# Altium project Dlgger_Prj.PrjPcb
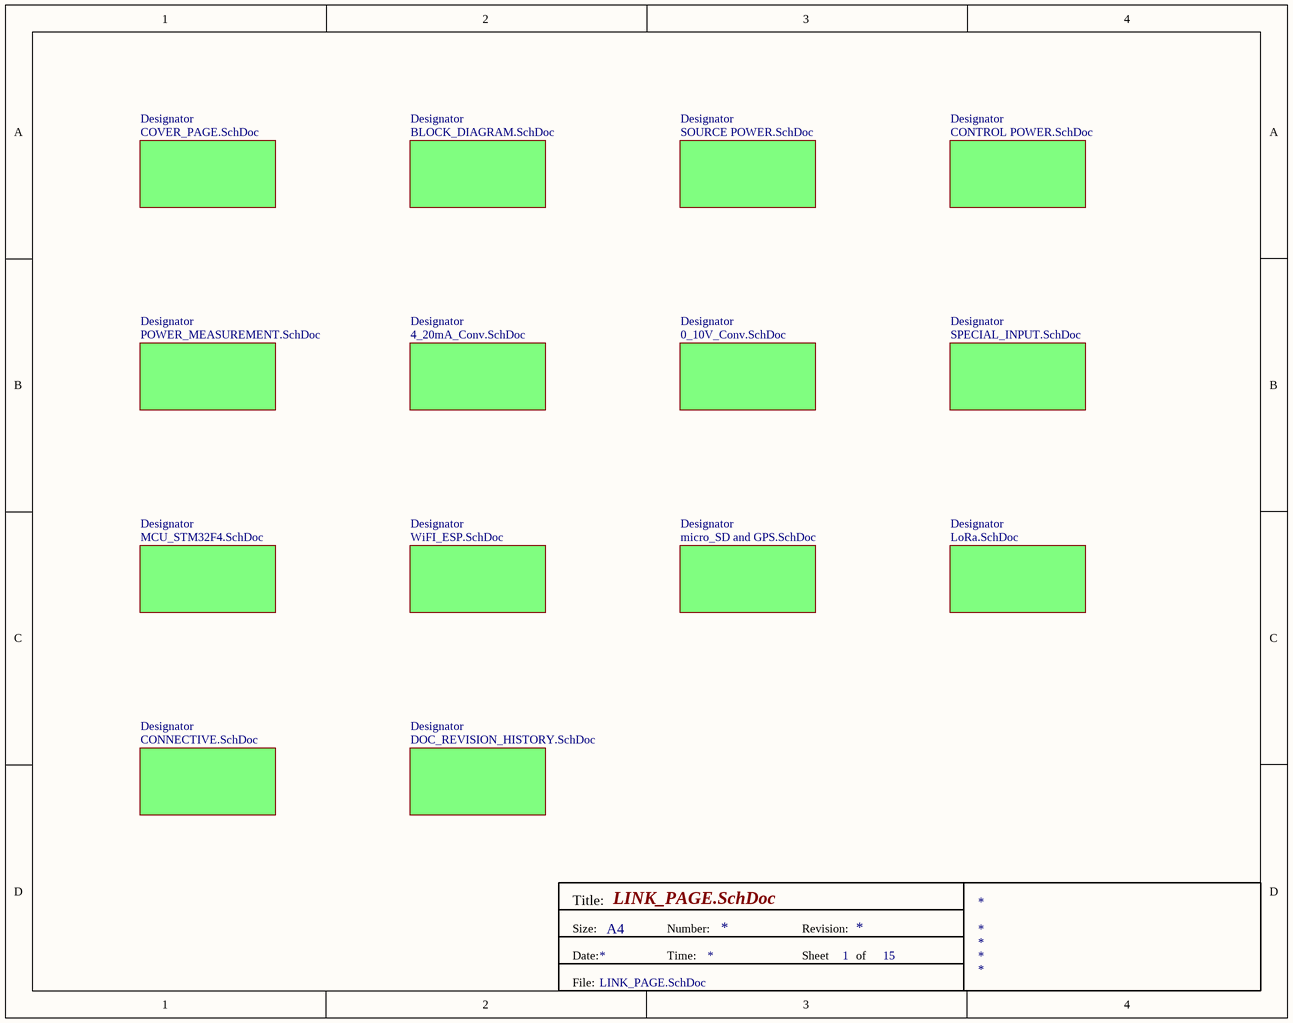
[diagram p0: LINK_PAGE.SchDoc]
15 sheets, 197 parts. Net scope: flat (ports and power ports of the same name join across sheets).
Sheets:
  LINK_PAGE.SchDoc
    Designator = COVER_PAGE.SchDoc
    Designator = BLOCK_DIAGRAM.SchDoc
    Designator = SOURCE POWER.SchDoc
    Designator = CONTROL POWER.SchDoc
    Designator = POWER_MEASUREMENT.SchDoc
    Designator = 4_20mA_Conv.SchDoc
    Designator = 0_10V_Conv.SchDoc
    Designator = SPECIAL_INPUT.SchDoc
    Designator = MCU_STM32F4.SchDoc
    Designator = WiFI_ESP.SchDoc
    Designator = micro_SD and GPS.SchDoc
    Designator = LoRa.SchDoc
    Designator = CONNECTIVE.SchDoc
    Designator = DOC_REVISION_HISTORY.SchDoc

## Sheet LINK_PAGE.SchDoc
size A; SheetNumber: 1; SheetTotal: 15

### Sub-sheets
Designator = COVER_PAGE.SchDoc: no entries
Designator = BLOCK_DIAGRAM.SchDoc: no entries
Designator = SOURCE POWER.SchDoc: no entries
Designator = CONTROL POWER.SchDoc: no entries
Designator = POWER_MEASUREMENT.SchDoc: no entries
Designator = 4_20mA_Conv.SchDoc: no entries
Designator = 0_10V_Conv.SchDoc: no entries
Designator = SPECIAL_INPUT.SchDoc: no entries
Designator = MCU_STM32F4.SchDoc: no entries
Designator = WiFI_ESP.SchDoc: no entries
Designator = micro_SD and GPS.SchDoc: no entries
Designator = LoRa.SchDoc: no entries
Designator = CONNECTIVE.SchDoc: no entries
Designator = DOC_REVISION_HISTORY.SchDoc: no entries

### Notes on the sheet
- Title:
- Size:
- Date:
- A4
- Number:
- Time:
- Revision:
- Sheet
- of
- File:

## Sheet COVER_PAGE.SchDoc
size A4; SheetNumber: 2; SheetTotal: 15
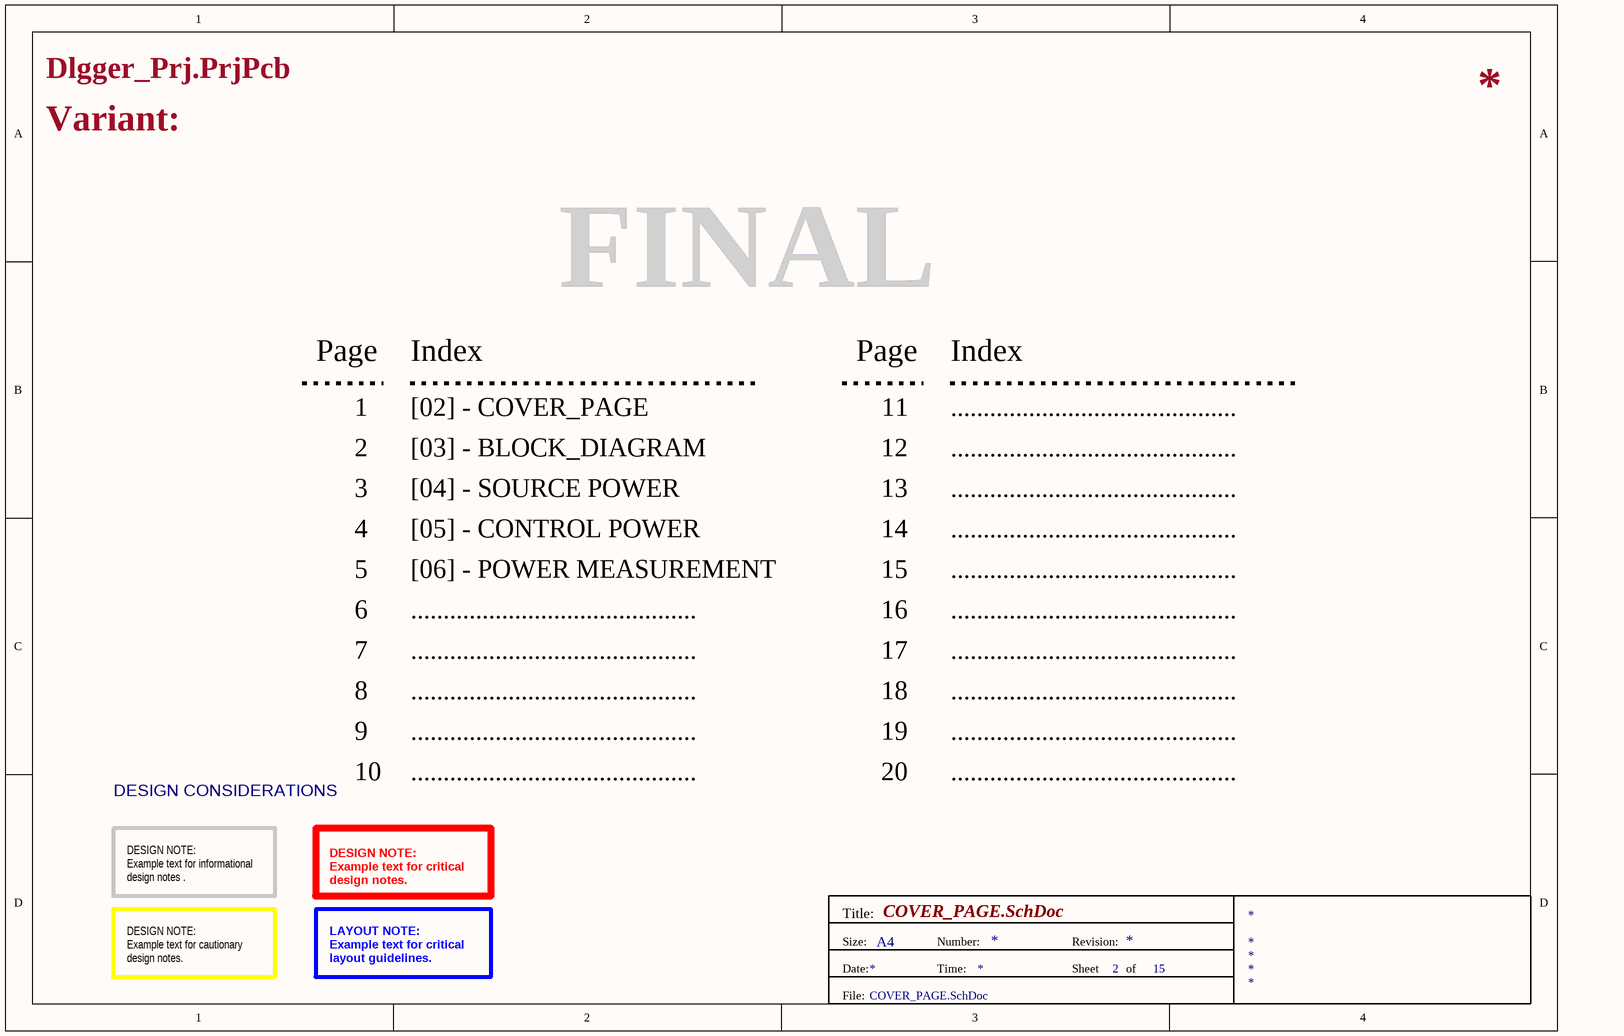
[diagram p1: COVER_PAGE.SchDoc]

### Notes on the sheet
- Variant:
- FINAL
- Page
- Index
- 1
- [02] - COVER_PAGE
- 11
- ............................................
- 2
- 3
- [03] - BLOCK_DIAGRAM
- [04] - SOURCE POWER
- 12
- 13
- 4
- 5
- [05] - CONTROL POWER
- [06] - POWER MEASUREMENT
- 14
- 15
- 6
- 16
- 7
- 8
- 17
- 18
- 9
- 10
- 19
- 20
- DESIGN CONSIDERATIONS
- DESIGN NOTE:
  Example text for informational
  design notes .
- DESIGN NOTE:
  Example text for critical
  design notes.
- Title:
- DESIGN NOTE:
  Example text for cautionary
  design notes.
- LAYOUT NOTE:
  Example text for critical
  layout guidelines.
- Size:
- Date:
- A4
- Number:
- Time:
- Revision:
- Sheet
- of
- File:

## Sheet BLOCK_DIAGRAM.SchDoc
size A3; SheetNumber: 3; SheetTotal: 15
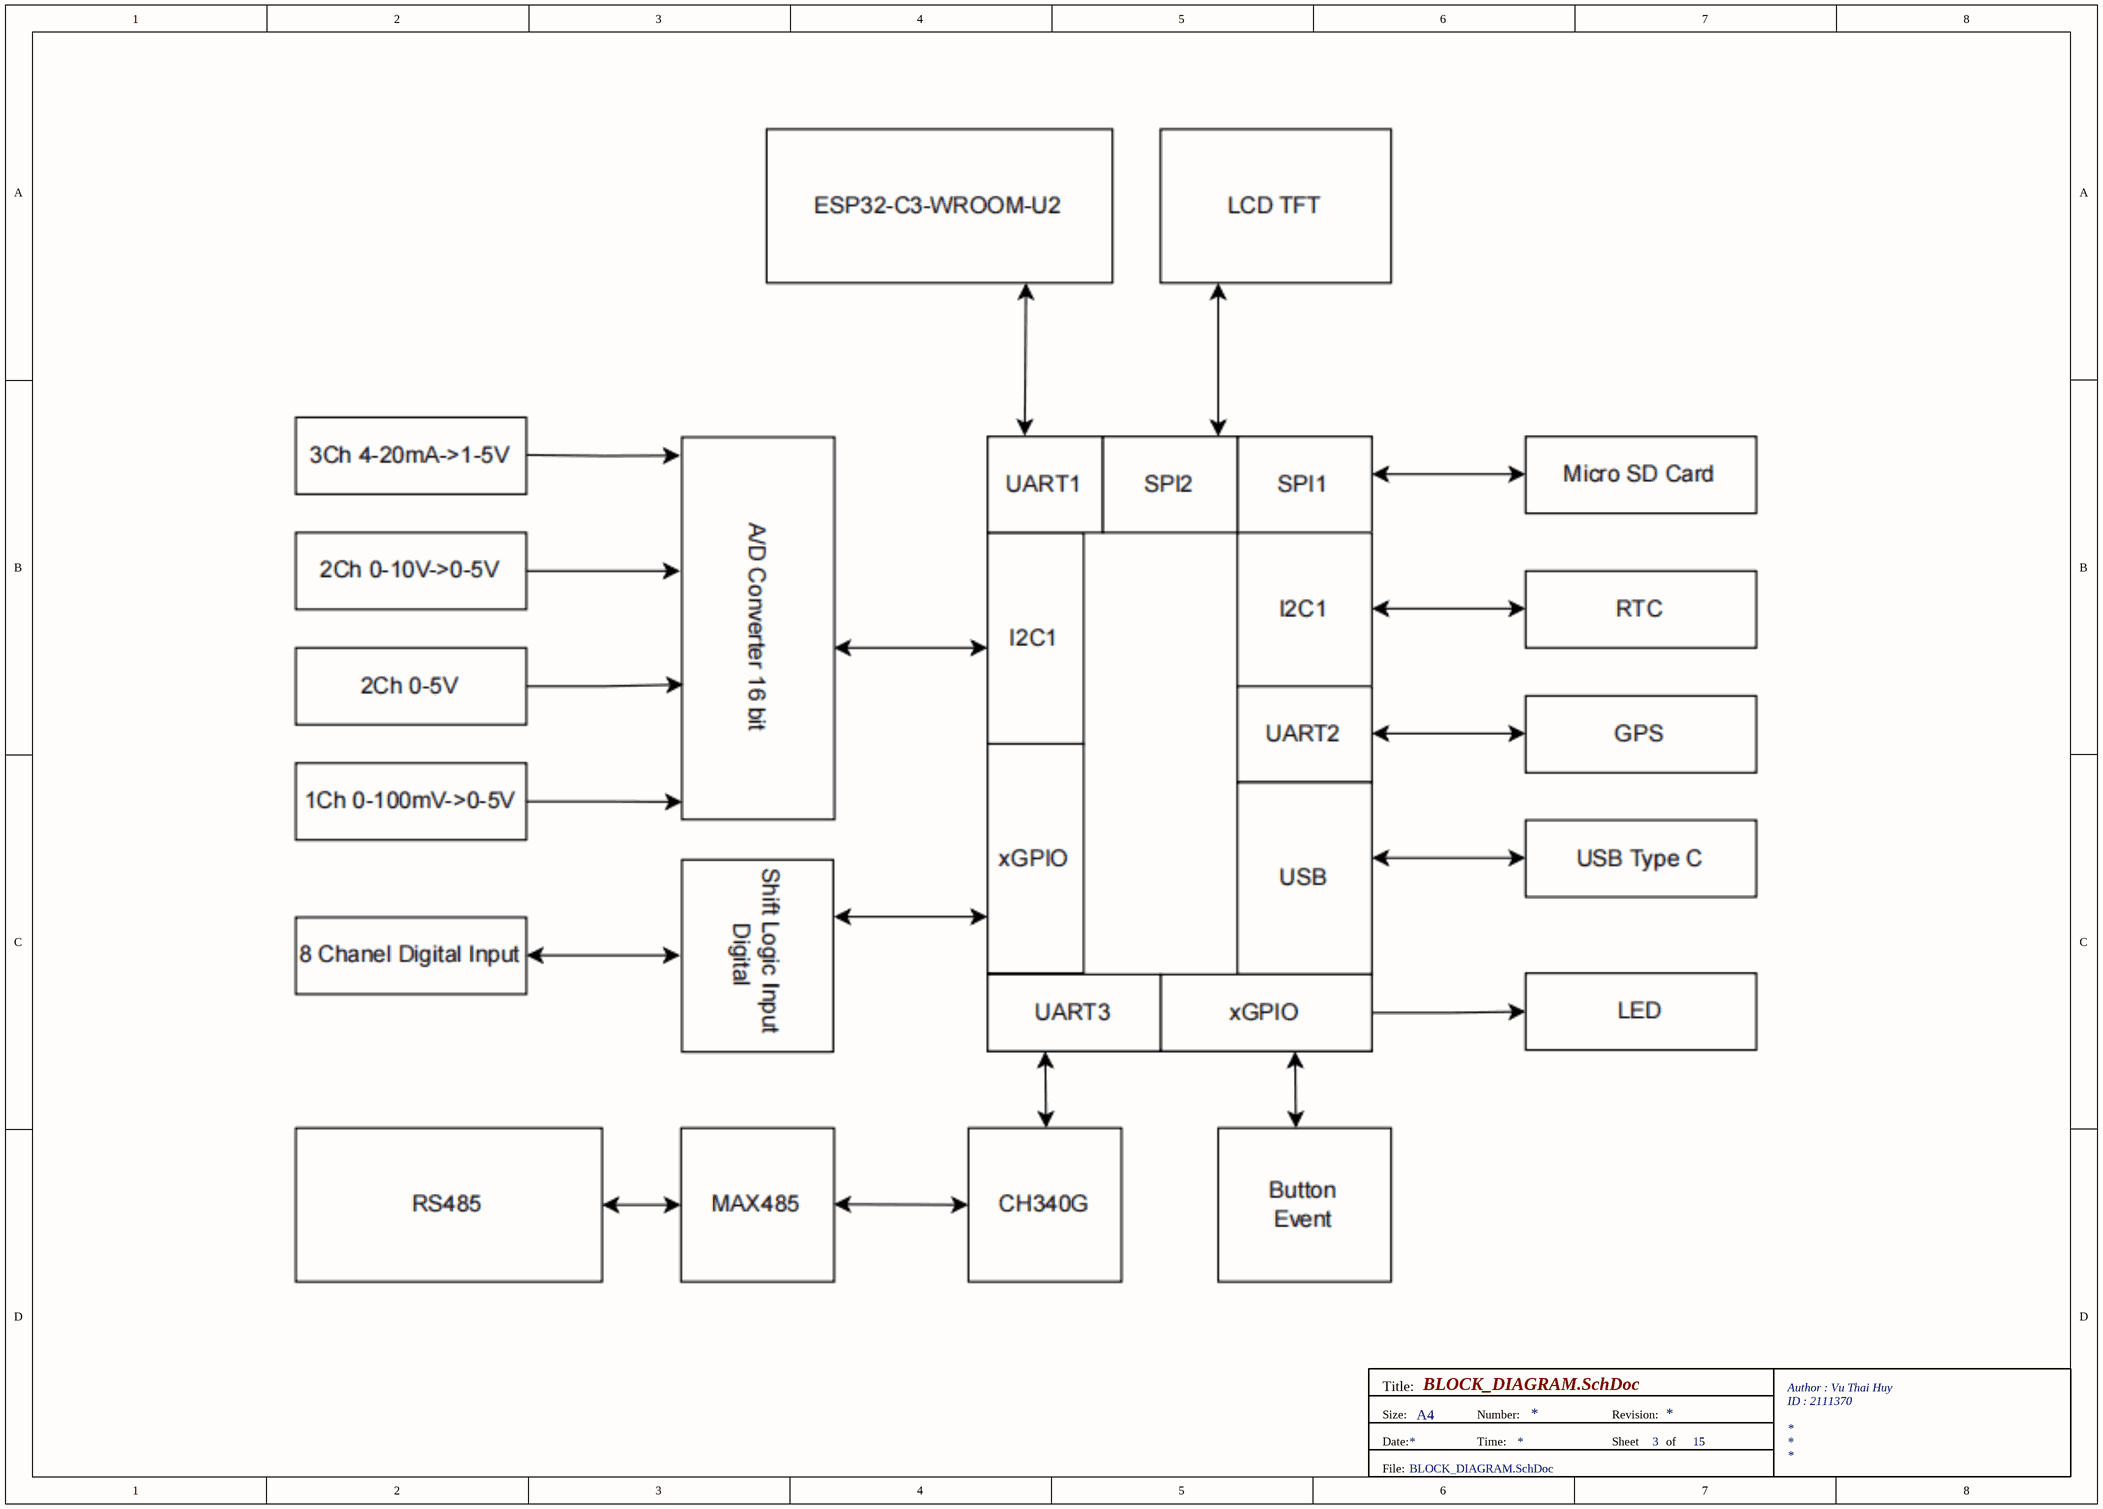
[diagram p2: BLOCK_DIAGRAM.SchDoc]

### Notes on the sheet
- Title:
- Author : Vu Thai Huy
- Size:
- Date:
- A4
- Number:
- Time:
- Revision:
- Sheet
- of
- ID : 2111370
- File:

## Sheet SOURCE POWER.SchDoc
size A3; SheetNumber: 4; SheetTotal: 15
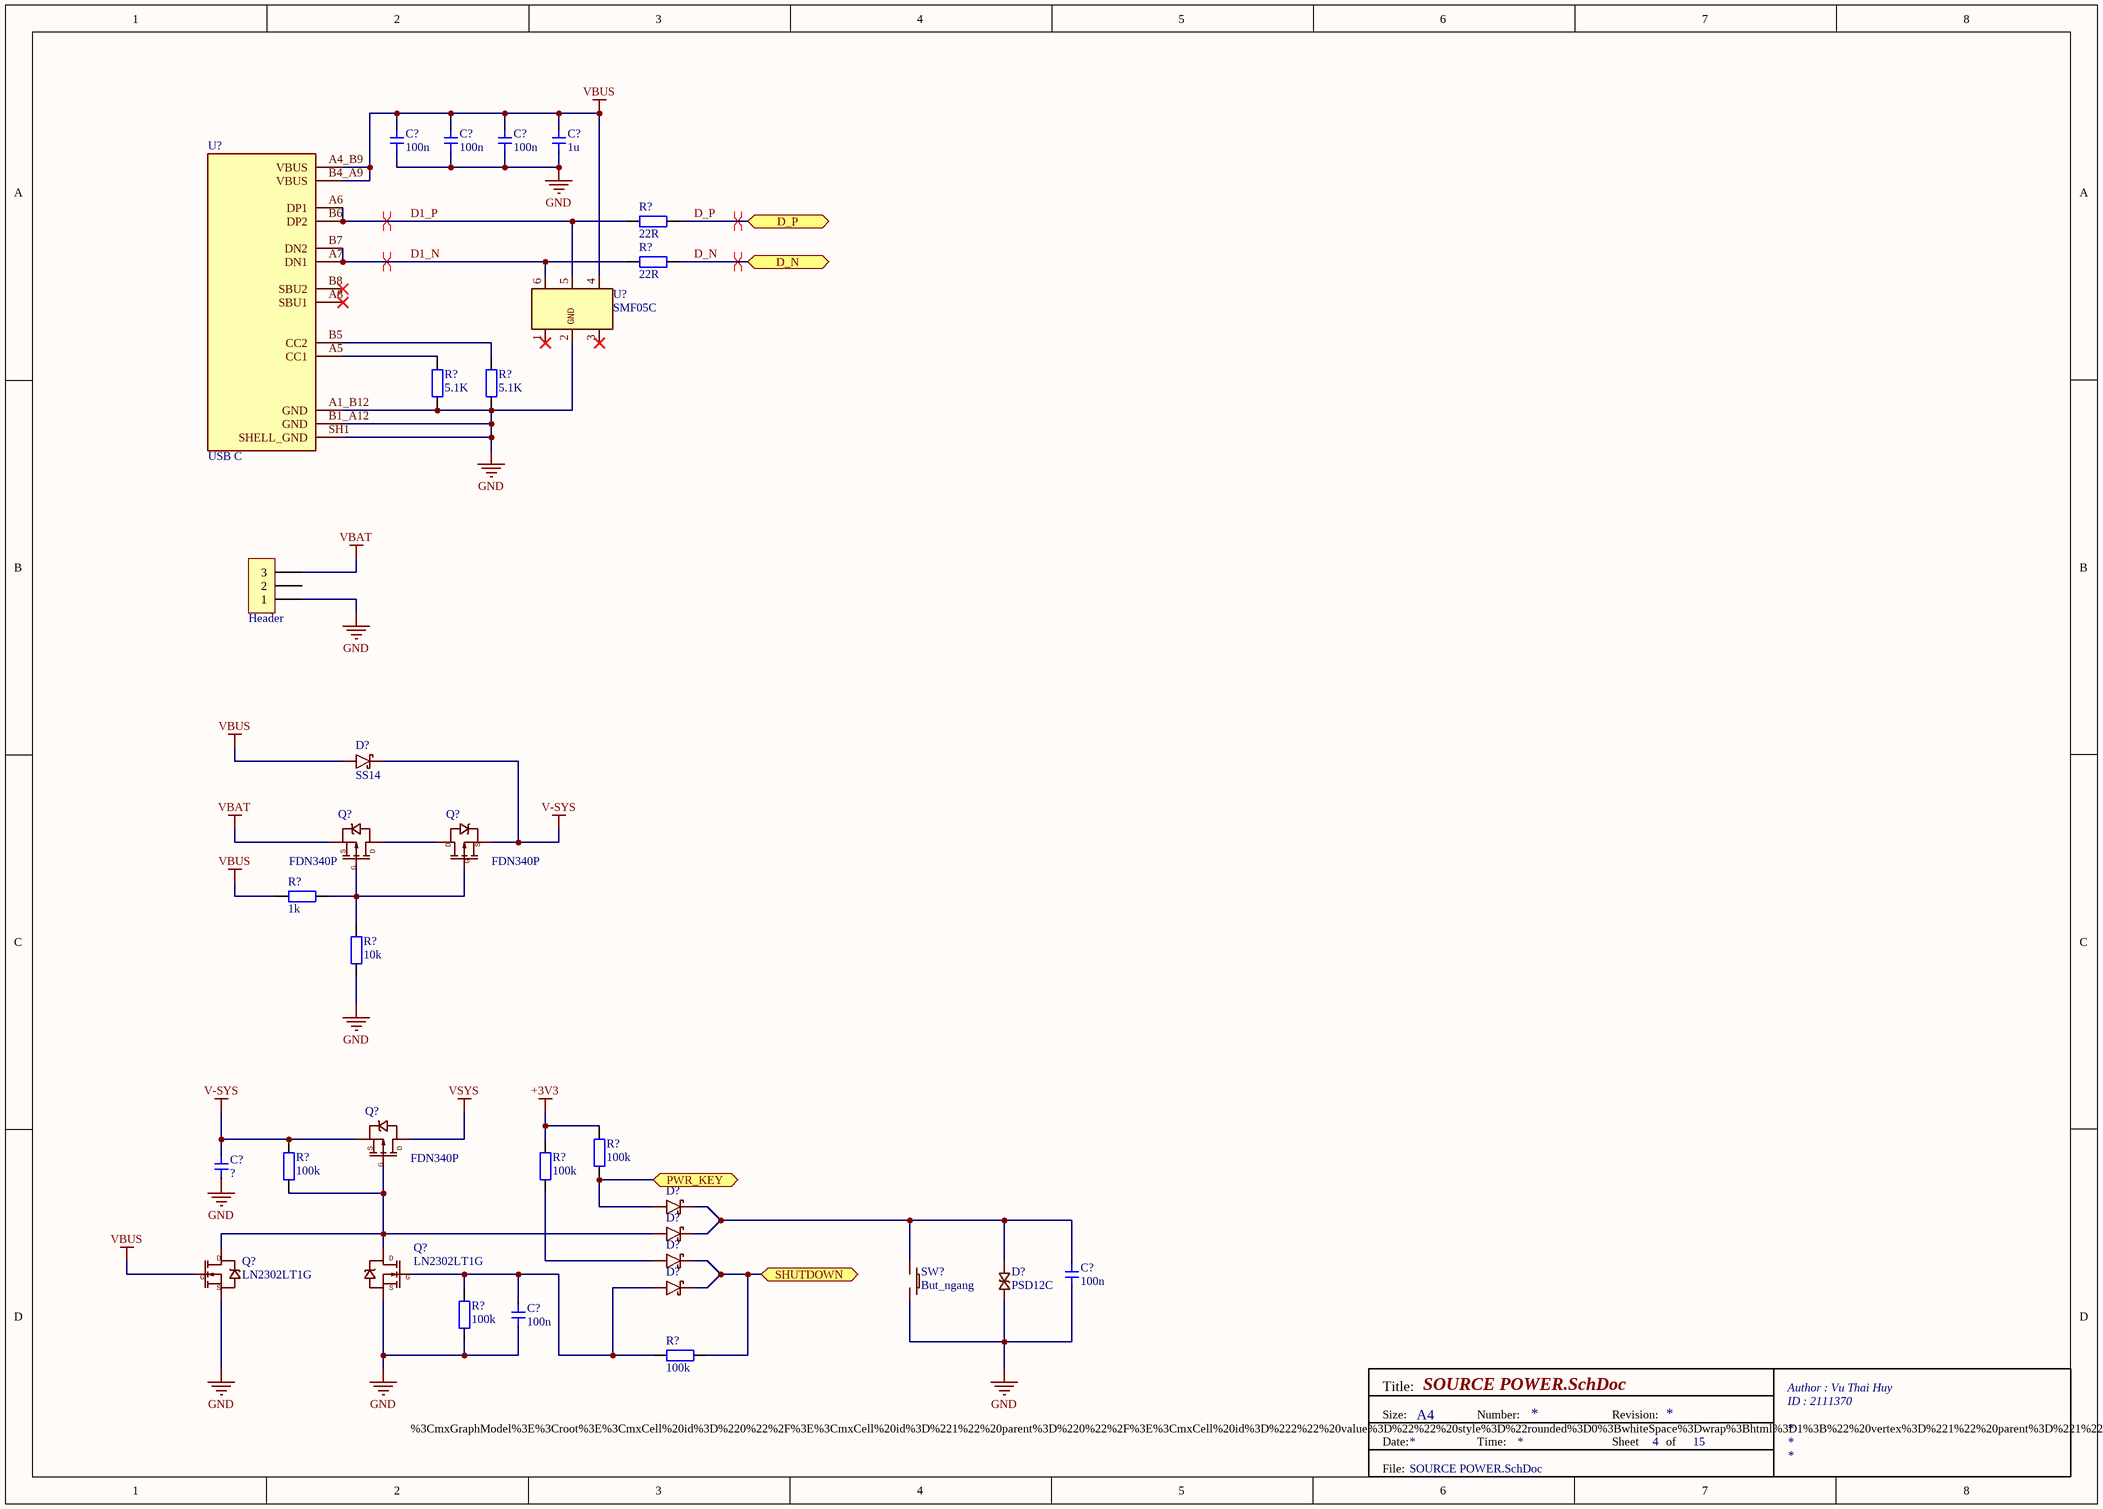
[diagram p3: SOURCE POWER.SchDoc]

### Parts
(Parts that share a designator on the sheet are numbered #1, #2 ... from top to bottom, then left to right.)
C?#1  100n  [Cap 0603]
C?#2  100n  [Cap 0603]
C?#3  100n  [Cap 0603]
C?#4  1u  [Cap 0603]
C?#5  ?  [Cap 0603]
C?#6  100n  [Cap 0603]
C?#7  100n  [Cap 0603]
D?#1  SS14  [SS14]
D?#2  1N5819W  [1N5418W]  (value not drawn)
D?#3  1N5819W  [1N5418W]  (value not drawn)
D?#4  1N5819W  [1N5418W]  (value not drawn)
D?#5  PSD12C  [SOD-323]
D?#6  1N5819W  [1N5418W]  (value not drawn)
H?  Header  [Header 3P DC 2.54]
Q?#1  FDN340P  [FDN340P]
Q?#2  FDN340P  [FDN340P]
Q?#3  FDN340P  [FDN340P]
Q?#4  LN2302LT1G  [FDN340P]
Q?#5  LN2302LT1G  [FDN340P]
R?#1  22R  [tro smd 0603]
R?#2  22R  [tro smd 0603]
R?#3  5.1K  [tro smd 0603]
R?#4  5.1K  [tro smd 0603]
R?#5  1k  [tro smd 0603]
R?#6  10k  [tro smd 0603]
R?#7  100k  [tro smd 0603]
R?#8  100k  [tro smd 0603]
R?#9  100k  [tro smd 0603]
R?#10  100k  [tro smd 0603]
R?#11  100k  [tro smd 0603]
SW?  But_ngang  [But_ngang]
U?#1  SMF05C  [SOT-363]
U?#2  USB C  [USB C]

### Ports
D_N (bidir), D_P (bidir), PWR_KEY (bidir), SHUTDOWN (bidir)

### Nets
+3V3: R?#7.2 R?#9.2  [project net EN]
GND: C?#1.2 C?#2.2 C?#3.2 C?#4.2 C?#5.2 C?#6.2 C?#7.2 D?#5.C H?.1 Q?#4.2 Q?#5.2 R?#3.1 R?#4.1 R?#6.1 R?#10.1 SW?.2 U?#1.2(GND) U?#2.A1_B12(GND) U?#2.B1_A12(GND) U?#2.SH1(SHELL_GND)  [project net AGND]
V-SYS: C?#5.1 D?#1.2 Q?#2.2 Q?#3.2 R?#8.2
VBAT: H?.3 Q?#1.2
VBUS: C?#1.1 C?#2.1 C?#3.1 C?#4.1 D?#1.1 Q?#4.1 R?#5.1 U?#1.4(IN3) U?#2.A4_B9(VBUS) U?#2.B4_A9(VBUS)
VSYS: Q?#3.3
D1_N: R?#2.1 U?#1.6(IN4) U?#2.A7(DN1) U?#2.B7(DN2)
D1_P: R?#1.1 U?#1.5(IN4) U?#2.A6(DP1) U?#2.B6(DP2)
D_N: R?#2.2 ; port D_N
D_P: R?#1.2 ; port D_P
NetC?#6_1: C?#6.1 D?#2.K D?#3.K D?#5.A SW?.1
NetC?#7_1: C?#7.1 D?#6.A Q?#5.1 R?#10.2 R?#11.1
NetD?#2_A: D?#2.A R?#7.1 ; port PWR_KEY
NetD?#3_A: D?#3.A Q?#3.1 Q?#4.3 Q?#5.3 R?#8.1
NetD?#4_A: D?#4.A R?#9.1
NetD?#4_K: D?#4.K D?#6.K R?#11.2 ; port SHUTDOWN
NetQ?#1_1: Q?#1.1 Q?#2.1 R?#5.2 R?#6.2
NetQ?#1_3: Q?#1.3 Q?#2.3
NetR?#3_2: R?#3.2 U?#2.A5(CC1)
NetR?#4_2: R?#4.2 U?#2.B5(CC2)

Not connected (* = marked no-connect by the designer): H? 2; U?#1 1(IN1)* 3(IN2)*; U?#2 A8(SBU1)* B8(SBU2)*

### Layout directives
differential pair: D1_N, D1_P, D_N, D_P

### Notes on the sheet
- Title:
- Author : Vu Thai Huy
- %3CmxGraphModel%3E%3Croot%3E%3CmxCell%20id%3D%220%22%2F%3E%3CmxCell%20id%3D%221%22%20parent%3D%220%22%2F%3E%3CmxCell%20id%3D%222%22%20value%3D%22%22%20style%3D%22rounded%3D0%3BwhiteSpace%3Dwrap%3Bhtml%3D1%3B%22%20vertex%3D%221%22%20parent%3D%221%22%3E%3CmxGeometry%20x%3D%22360%22%20y%3D%22320%22%20width%3D%22200%22%20height%3D%22320%22%20as%3D%22geometry%22%2F%3E%3C%2FmxCell%3E%3CmxCell%20id%3D%223%22%20value%3D%22USB%20Type%20C%22%20style%3D%22rounded%3D0%3BwhiteSpace%3Dwrap%3Bhtml%3D1%3B%22%20vertex%3D%221%22%20parent%3D%221%22%3E%3CmxGeometry%20x%3D%22640%22%20y%3D%22519.68%22%20width%3D%22120%22%20height%3D%2240%22%20as%3D%22geometry%22%2F%3E%3C%2FmxCell%3E%3CmxCell%20id%3D%224%22%20value%3D%22A%2FD%20Converter%2016%20bit%22%20style%3D%22rounded%3D0%3BwhiteSpace%3Dwrap%3Bhtml%3D1%3Brotation%3D90%3B%22%20vertex%3D%221%22%20parent%3D%221%22%3E%3CmxGeometry%20x%3D%22141.09%22%20y%3D%22380.16%22%20width%3D%22199.07%22%20height%3D%2279.37%22%20as%3D%22geometry%22%2F%3E%3C%2FmxCell%3E%3CmxCell%20id%3D%225%22%20style%3D%22edgeStyle%3DorthogonalEdgeStyle%3Brounded%3D0%3BorthogonalLoop%3D1%3BjettySize%3Dauto%3Bhtml%3D1%3BexitX%3D0.5%3BexitY%3D0%3BexitDx%3D0%3BexitDy%3D0%3B%22%20edge%3D%221%22%20parent%3D%221%22%3E%3CmxGeometry%20relative%3D%221%22%20as%3D%22geometry%22%3E%3CmxPoint%20x%3D%22200%22%20y%3D%22329.9233333333334%22%20as%3D%22targetPoint%22%2F%3E%3CmxPoint%20x%3D%22120%22%20y%3D%22329.59000000000003%22%20as%3D%22sourcePoint%22%2F%3E%3C%2FmxGeometry%3E%3C%2FmxCell%3E%3CmxCell%20id%3D%226%22%20value%3D%22Shift%20Logic%20Input%26amp%3Bnbsp%3B%26lt%3Bbr%26gt%3BDigital%22%20style%3D%22rounded%3D0%3BwhiteSpace%3Dwrap%3Bhtml%3D1%3Brotation%3D90%3B%22%20vertex%3D%221%22%20parent%3D%221%22%3E%3CmxGeometry%20x%3D%22190.31%22%20y%3D%22550.94%22%20width%3D%22100%22%20height%3D%2278.75%22%20as%3D%22geometry%22%2F%3E%3C%2FmxCell%3E%3CmxCell%20id%3D%227%22%20value%3D%228%20Chanel%20Digital%20Input%22%20style%3D%22rounded%3D0%3BwhiteSpace%3Dwrap%3Bhtml%3D1%3Brotation%3D0%3B%22%20vertex%3D%221%22%20parent%3D%221%22%3E%3CmxGeometry%20x%3D%227.105427357601002e-15%22%20y%3D%22570.32%22%20width%3D%22120%22%20height%3D%2240%22%20as%3D%22geometry%22%2F%3E%3C%2FmxCell%3E%3CmxCell%20id%3D%228%22%20value%3D%22GPS%22%20style%3D%22rounded%3D0%3BwhiteSpace%3Dwrap%3Bhtml%3D1%3B%22%20vertex%3D%221%22%20parent%3D%221%22%3E%3CmxGeometry%20x%3D%22640%22%20y%3D%22455%22%20width%3D%22120%22%20height%3D%2240%22%20as%3D%22geometry%22%2F%3E%3C%2FmxCell%3E%3CmxCell%20id%3D%229%22%20value%3D%22Micro%20SD%20Card%22%20style%3D%22rounded%3D0%3BwhiteSpace%3Dwrap%3Bhtml%3D1%3B%22%20vertex%3D%221%22%20parent%3D%221%22%3E%3CmxGeometry%20x%3D%22640%22%20y%3D%22320%22%20width%3D%22120%22%20height%3D%2240%22%20as%3D%22geometry%22%2F%3E%3C%2FmxCell%3E%3CmxCell%20id%3D%2210%22%20value%3D%22RTC%22%20style%3D%22rounded%3D0%3BwhiteSpace%3Dwrap%3Bhtml%3D1%3B%22%20vertex%3D%221%22%20parent%3D%221%22%3E%3CmxGeometry%20x%3D%22640%22%20y%3D%22390%22%20width%3D%22120%22%20height%3D%2240%22%20as%3D%22geometry%22%2F%3E%3C%2FmxCell%3E%3CmxCell%20id%3D%2211%22%20value%3D%22%22%20style%3D%22endArrow%3Dclassic%3BstartArrow%3Dclassic%3Bhtml%3D1%3Brounded%3D0%3BentryX%3D0%3BentryY%3D0.25%3BentryDx%3D0%3BentryDy%3D0%3B%22%20edge%3D%221%22%20parent%3D%221%22%3E%3CmxGeometry%20width%3D%2250%22%20height%3D%2250%22%20relative%3D%221%22%20as%3D%22geometry%22%3E%3CmxPoint%20x%3D%22280%22%20y%3D%22430%22%20as%3D%22sourcePoint%22%2F%3E%3CmxPoint%20x%3D%22360%22%20y%3D%22430%22%20as%3D%22targetPoint%22%2F%3E%3C%2FmxGeometry%3E%3C%2FmxCell%3E%3CmxCell%20id%3D%2212%22%20value%3D%22%22%20style%3D%22endArrow%3Dclassic%3BstartArrow%3Dclassic%3Bhtml%3D1%3Brounded%3D0%3BentryX%3D0%3BentryY%3D0.25%3BentryDx%3D0%3BentryDy%3D0%3B%22%20edge%3D%221%22%20parent%3D%221%22%3E%3CmxGeometry%20width%3D%2250%22%20height%3D%2250%22%20relative%3D%221%22%20as%3D%22geometry%22%3E%3CmxPoint%20x%3D%22280%22%20y%3D%22570%22%20as%3D%22sourcePoint%22%2F%3E%3CmxPoint%20x%3D%22360%22%20y%3D%22570%22%20as%3D%22targetPoint%22%2F%3E%3C%2FmxGeometry%3E%3C%2FmxCell%3E%3CmxCell%20id%3D%2213%22%20value%3D%22%22%20style%3D%22endArrow%3Dclassic%3BstartArrow%3Dclassic%3Bhtml%3D1%3Brounded%3D0%3BentryX%3D0%3BentryY%3D0.25%3BentryDx%3D0%3BentryDy%3D0%3B%22%20edge%3D%221%22%20parent%3D%221%22%3E%3CmxGeometry%20width%3D%2250%22%20height%3D%2250%22%20relative%3D%221%22%20as%3D%22geometry%22%3E%3CmxPoint%20x%3D%22120%22%20y%3D%22590.08%22%20as%3D%22sourcePoint%22%2F%3E%3CmxPoint%20x%3D%22200%22%20y%3D%22590.08%22%20as%3D%22targetPoint%22%2F%3E%3C%2FmxGeometry%3E%3C%2FmxCell%3E%3CmxCell%20id%3D%2214%22%20value%3D%22%22%20style%3D%22endArrow%3Dclassic%3BstartArrow%3Dclassic%3Bhtml%3D1%3Brounded%3D0%3BentryX%3D0%3BentryY%3D0.25%3BentryDx%3D0%3BentryDy%3D0%3B%22%20edge%3D%221%22%20parent%3D%221%22%3E%3CmxGeometry%20width%3D%2250%22%20height%3D%2250%22%20relative%3D%221%22%20as%3D%22geometry%22%3E%3CmxPoint%20x%3D%22560%22%20y%3D%22539.38%22%20as%3D%22sourcePoint%22%2F%3E%3CmxPoint%20x%3D%22640%22%20y%3D%22539.38%22%20as%3D%22targetPoint%22%2F%3E%3C%2FmxGeometry%3E%3C%2FmxCell%3E%3CmxCell%20id%3D%2215%22%20value%3D%22%22%20style%3D%22endArrow%3Dclassic%3BstartArrow%3Dclassic%3Bhtml%3D1%3Brounded%3D0%3BentryX%3D0%3BentryY%3D0.25%3BentryDx%3D0%3BentryDy%3D0%3B%22%20edge%3D%221%22%20parent%3D%221%22%3E%3CmxGeometry%20width%3D%2250%22%20height%3D%2250%22%20relative%3D%221%22%20as%3D%22geometry%22%3E%3CmxPoint%20x%3D%22560%22%20y%3D%22474.5799999999999%22%20as%3D%22sourcePoint%22%2F%3E%3CmxPoint%20x%3D%22640%22%20y%3D%22474.5799999999999%22%20as%3D%22targetPoint%22%2F%3E%3C%2FmxGeometry%3E%3C%2FmxCell%3E%3CmxCell%20id%3D%2216%22%20value%3D%22%22%20style%3D%22endArrow%3Dclassic%3BstartArrow%3Dclassic%3Bhtml%3D1%3Brounded%3D0%3BentryX%3D0%3BentryY%3D0.25%3BentryDx%3D0%3BentryDy%3D0%3B%22%20edge%3D%221%22%20parent%3D%221%22%3E%3CmxGeometry%20width%3D%2250%22%20height%3D%2250%22%20relative%3D%221%22%20as%3D%22geometry%22%3E%3CmxPoint%20x%3D%22560%22%20y%3D%22339.58%22%20as%3D%22sourcePoint%22%2F%3E%3CmxPoint%20x%3D%22640%22%20y%3D%22339.58%22%20as%3D%22targetPoint%22%2F%3E%3C%2FmxGeometry%3E%3C%2FmxCell%3E%3CmxCell%20id%3D%2217%22%20value%3D%22%22%20style%3D%22endArrow%3Dclassic%3BstartArrow%3Dclassic%3Bhtml%3D1%3Brounded%3D0%3BentryX%3D0%3BentryY%3D0.25%3BentryDx%3D0%3BentryDy%3D0%3B%22%20edge%3D%221%22%20parent%3D%221%22%3E%3CmxGeometry%20width%3D%2250%22%20height%3D%2250%22%20relative%3D%221%22%20as%3D%22geometry%22%3E%3CmxPoint%20x%3D%22560%22%20y%3D%22409.58%22%20as%3D%22sourcePoint%22%2F%3E%3CmxPoint%20x%3D%22640%22%20y%3D%22409.58%22%20as%3D%22targetPoint%22%2F%3E%3C%2FmxGeometry%3E%3C%2FmxCell%3E%3CmxCell%20id%3D%2218%22%20value%3D%22ESP32-C3-WROOM-U2%22%20style%3D%22rounded%3D0%3BwhiteSpace%3Dwrap%3Bhtml%3D1%3B%22%20vertex%3D%221%22%20parent%3D%221%22%3E%3CmxGeometry%20x%3D%22245%22%20y%3D%22160%22%20width%3D%22180%22%20height%3D%2280%22%20as%3D%22geometry%22%2F%3E%3C%2FmxCell%3E%3CmxCell%20id%3D%2219%22%20value%3D%22%22%20style%3D%22endArrow%3Dclassic%3BstartArrow%3Dclassic%3Bhtml%3D1%3Brounded%3D0%3BentryX%3D0.75%3BentryY%3D1%3BentryDx%3D0%3BentryDy%3D0%3BexitX%3D0.322%3BexitY%3D-0.005%3BexitDx%3D0%3BexitDy%3D0%3BexitPerimeter%3D0%3B%22%20edge%3D%221%22%20source%3D%2227%22%20target%3D%2218%22%20parent%3D%221%22%3E%3CmxGeometry%20width%3D%2250%22%20height%3D%2250%22%20relative%3D%221%22%20as%3D%22geometry%22%3E%3CmxPoint%20x%3D%22370%22%20y%3D%22430%22%20as%3D%22sourcePoint%22%2F%3E%3CmxPoint%20x%3D%22420%22%20y%3D%22380%22%20as%3D%22targetPoint%22%2F%3E%3C%2FmxGeometry%3E%3C%2FmxCell%3E%3CmxCell%20id%3D%2220%22%20value%3D%22MAX485%22%20style%3D%22rounded%3D0%3BwhiteSpace%3Dwrap%3Bhtml%3D1%3Brotation%3D0%3B%22%20vertex%3D%221%22%20parent%3D%221%22%3E%3CmxGeometry%20x%3D%22200.46999999999994%22%20y%3D%22680%22%20width%3D%2279.69%22%20height%3D%2280%22%20as%3D%22geometry%22%2F%3E%3C%2FmxCell%3E%3CmxCell%20id%3D%2221%22%20value%3D%22RS485%22%20style%3D%22rounded%3D0%3BwhiteSpace%3Dwrap%3Bhtml%3D1%3Brotation%3D0%3B%22%20vertex%3D%221%22%20parent%3D%221%22%3E%3CmxGeometry%20y%3D%22680%22%20width%3D%22159.38%22%20height%3D%2280%22%20as%3D%22geometry%22%2F%3E%3C%2FmxCell%3E%3CmxCell%20id%3D%2222%22%20value%3D%22%22%20style%3D%22endArrow%3Dclassic%3BstartArrow%3Dclassic%3Bhtml%3D1%3Brounded%3D0%3BentryX%3D0%3BentryY%3D0.5%3BentryDx%3D0%3BentryDy%3D0%3BexitX%3D1%3BexitY%3D0.5%3BexitDx%3D0%3BexitDy%3D0%3B%22%20edge%3D%221%22%20source%3D%2221%22%20target%3D%2220%22%20parent%3D%221%22%3E%3CmxGeometry%20width%3D%2250%22%20height%3D%2250%22%20relative%3D%221%22%20as%3D%22geometry%22%3E%3CmxPoint%20x%3D%22260%22%20y%3D%22719.6300000000001%22%20as%3D%22sourcePoint%22%2F%3E%3CmxPoint%20x%3D%22340%22%20y%3D%22719.6300000000001%22%20as%3D%22targetPoint%22%2F%3E%3C%2FmxGeometry%3E%3C%2FmxCell%3E%3CmxCell%20id%3D%2223%22%20value%3D%22%22%20style%3D%22endArrow%3Dclassic%3BstartArrow%3Dclassic%3Bhtml%3D1%3Brounded%3D0%3BentryX%3D0.5%3BentryY%3D1%3BentryDx%3D0%3BentryDy%3D0%3B%22%20edge%3D%221%22%20parent%3D%221%22%3E%3CmxGeometry%20width%3D%2250%22%20height%3D%2250%22%20relative%3D%221%22%20as%3D%22geometry%22%3E%3CmxPoint%20x%3D%22390.43000000000006%22%20y%3D%22680%22%20as%3D%22sourcePoint%22%2F%3E%3CmxPoint%20x%3D%22390%22%20y%3D%22640%22%20as%3D%22targetPoint%22%2F%3E%3C%2FmxGeometry%3E%3C%2FmxCell%3E%3CmxCell%20id%3D%2224%22%20value%3D%22Button%26lt%3Bdiv%26gt%3BEvent%26lt%3B%2Fdiv%26gt%3B%22%20style%3D%22rounded%3D0%3BwhiteSpace%3Dwrap%3Bhtml%3D1%3Brotation%3D0%3B%22%20vertex%3D%221%22%20parent%3D%221%22%3E%3CmxGeometry%20x%3D%22480%22%20y%3D%22680%22%20width%3D%2290%22%20height%3D%2280%22%20as%3D%22geometry%22%2F%3E%3C%2FmxCell%3E%3CmxCell%20id%3D%2225%22%20value%3D%22%22%20style%3D%22endArrow%3Dclassic%3BstartArrow%3Dclassic%3Bhtml%3D1%3Brounded%3D0%3BentryX%3D0.5%3BentryY%3D1%3BentryDx%3D0%3BentryDy%3D0%3B%22%20edge%3D%221%22%20parent%3D%221%22%3E%3CmxGeometry%20width%3D%2250%22%20height%3D%2250%22%20relative%3D%221%22%20as%3D%22geometry%22%3E%3CmxPoint%20x%3D%22520.4300000000001%22%20y%3D%22680%22%20as%3D%22sourcePoint%22%2F%3E%3CmxPoint%20x%3D%22520%22%20y%3D%22640%22%20as%3D%22targetPoint%22%2F%3E%3C%2FmxGeometry%3E%3C%2FmxCell%3E%3CmxCell%20id%3D%2226%22%20value%3D%22I2C1%22%20style%3D%22rounded%3D0%3BwhiteSpace%3Dwrap%3Bhtml%3D1%3B%22%20vertex%3D%221%22%20parent%3D%221%22%3E%3CmxGeometry%20x%3D%22360%22%20y%3D%22370%22%20width%3D%2250%22%20height%3D%22110%22%20as%3D%22geometry%22%2F%3E%3C%2FmxCell%3E%3CmxCell%20id%3D%2227%22%20value%3D%22UART1%22%20style%3D%22rounded%3D0%3BwhiteSpace%3Dwrap%3Bhtml%3D1%3B%22%20vertex%3D%221%22%20parent%3D%221%22%3E%3CmxGeometry%20x%3D%22360%22%20y%3D%22320%22%20width%3D%2260%22%20height%3D%2250%22%20as%3D%22geometry%22%2F%3E%3C%2FmxCell%3E%3CmxCell%20id%3D%2228%22%20value%3D%22SPI1%22%20style%3D%22rounded%3D0%3BwhiteSpace%3Dwrap%3Bhtml%3D1%3B%22%20vertex%3D%221%22%20parent%3D%221%22%3E%3CmxGeometry%20x%3D%22490%22%20y%3D%22320%22%20width%3D%2270%22%20height%3D%2250%22%20as%3D%22geometry%22%2F%3E%3C%2FmxCell%3E%3CmxCell%20id%3D%2229%22%20value%3D%22I2C1%22%20style%3D%22rounded%3D0%3BwhiteSpace%3Dwrap%3Bhtml%3D1%3B%22%20vertex%3D%221%22%20parent%3D%221%22%3E%3CmxGeometry%20x%3D%22490%22%20y%3D%22370%22%20width%3D%2270%22%20height%3D%2280%22%20as%3D%22geometry%22%2F%3E%3C%2FmxCell%3E%3CmxCell%20id%3D%2230%22%20value%3D%22UART2%22%20style%3D%22rounded%3D0%3BwhiteSpace%3Dwrap%3Bhtml%3D1%3B%22%20vertex%3D%221%22%20parent%3D%221%22%3E%3CmxGeometry%20x%3D%22490%22%20y%3D%22450%22%20width%3D%2270%22%20height%3D%2250%22%20as%3D%22geometry%22%2F%3E%3C%2FmxCell%3E%3CmxCell%20id%3D%2231%22%20value%3D%22USB%22%20style%3D%22rounded%3D0%3BwhiteSpace%3Dwrap%3Bhtml%3D1%3B%22%20vertex%3D%221%22%20parent%3D%221%22%3E%3CmxGeometry%20x%3D%22490%22%20y%3D%22500%22%20width%3D%2270%22%20height%3D%22100%22%20as%3D%22geometry%22%2F%3E%3C%2FmxCell%3E%3CmxCell%20id%3D%2232%22%20style%3D%22edgeStyle%3DorthogonalEdgeStyle%3Brounded%3D0%3BorthogonalLoop%3D1%3BjettySize%3Dauto%3Bhtml%3D1%3BexitX%3D1%3BexitY%3D0.5%3BexitDx%3D0%3BexitDy%3D0%3BentryX%3D0%3BentryY%3D0.5%3BentryDx%3D0%3BentryDy%3D0%3B%22%20edge%3D%221%22%20source%3D%2233%22%20target%3D%2236%22%20parent%3D%221%22%3E%3CmxGeometry%20relative%3D%221%22%20as%3D%22geometry%22%2F%3E%3C%2FmxCell%3E%3CmxCell%20id%3D%2233%22%20value%3D%22xGPIO%22%20style%3D%22rounded%3D0%3BwhiteSpace%3Dwrap%3Bhtml%3D1%3B%22%20vertex%3D%221%22%20parent%3D%221%22%3E%3CmxGeometry%20x%3D%22450%22%20y%3D%22600%22%20width%3D%22110%22%20height%3D%2240%22%20as%3D%22geometry%22%2F%3E%3C%2FmxCell%3E%3CmxCell%20id%3D%2234%22%20value%3D%22UART3%22%20style%3D%22rounded%3D0%3BwhiteSpace%3Dwrap%3Bhtml%3D1%3B%22%20vertex%3D%221%22%20parent%3D%221%22%3E%3CmxGeometry%20x%3D%22360%22%20y%3D%22600%22%20width%3D%2290%22%20height%3D%2240%22%20as%3D%22geometry%22%2F%3E%3C%2FmxCell%3E%3CmxCell%20id%3D%2235%22%20value%3D%22xGPIO%22%20style%3D%22rounded%3D0%3BwhiteSpace%3Dwrap%3Bhtml%3D1%3B%22%20vertex%3D%221%22%20parent%3D%221%22%3E%3CmxGeometry%20x%3D%22360%22%20y%3D%22480%22%20width%3D%2250%22%20height%3D%22119.37%22%20as%3D%22geometry%22%2F%3E%3C%2FmxCell%3E%3CmxCell%20id%3D%2236%22%20value%3D%22LED%22%20style%3D%22rounded%3D0%3BwhiteSpace%3Dwrap%3Bhtml%3D1%3B%22%20vertex%3D%221%22%20parent%3D%221%22%3E%3CmxGeometry%20x%3D%22640%22%20y%3D%22599.37%22%20width%3D%22120%22%20height%3D%2240%22%20as%3D%22geometry%22%2F%3E%3C%2FmxCell%3E%3CmxCell%20id%3D%2237%22%20value%3D%223Ch%204-20mA-%26amp%3Bgt%3B1-5V%22%20style%3D%22rounded%3D0%3BwhiteSpace%3Dwrap%3Bhtml%3D1%3B%22%20vertex%3D%221%22%20parent%3D%221%22%3E%3CmxGeometry%20y%3D%22310%22%20width%3D%22120%22%20height%3D%2240%22%20as%3D%22geometry%22%2F%3E%3C%2FmxCell%3E%3CmxCell%20id%3D%2238%22%20value%3D%222Ch%200-10V-%26amp%3Bgt%3B0-5V%22%20style%3D%22rounded%3D0%3BwhiteSpace%3Dwrap%3Bhtml%3D1%3B%22%20vertex%3D%221%22%20parent%3D%221%22%3E%3CmxGeometry%20y%3D%22370%22%20width%3D%22120%22%20height%3D%2240%22%20as%3D%22geometry%22%2F%3E%3C%2FmxCell%3E%3CmxCell%20id%3D%2239%22%20value%3D%222Ch%200-5V%22%20style%3D%22rounded%3D0%3BwhiteSpace%3Dwrap%3Bhtml%3D1%3B%22%20vertex%3D%221%22%20parent%3D%221%22%3E%3CmxGeometry%20y%3D%22430%22%20width%3D%22120%22%20height%3D%2240%22%20as%3D%22geometry%22%2F%3E%3C%2FmxCell%3E%3CmxCell%20id%3D%2240%22%20value%3D%221Ch%200-100mV-%26amp%3Bgt%3B0-5V%22%20style%3D%22rounded%3D0%3BwhiteSpace%3Dwrap%3Bhtml%3D1%3Brotation%3D0%3B%22%20vertex%3D%221%22%20parent%3D%221%22%3E%3CmxGeometry%20x%3D%227.105427357601002e-15%22%20y%3D%22490%22%20width%3D%22120%22%20height%3D%2240%22%20as%3D%22geometry%22%2F%3E%3C%2FmxCell%3E%3CmxCell%20id%3D%2241%22%20style%3D%22edgeStyle%3DorthogonalEdgeStyle%3Brounded%3D0%3BorthogonalLoop%3D1%3BjettySize%3Dauto%3Bhtml%3D1%3BexitX%3D1%3BexitY%3D0.5%3BexitDx%3D0%3BexitDy%3D0%3BentryX%3D0.35%3BentryY%3D1.012%3BentryDx%3D0%3BentryDy%3D0%3BentryPerimeter%3D0%3B%22%20edge%3D%221%22%20source%3D%2238%22%20target%3D%224%22%20parent%3D%221%22%3E%3CmxGeometry%20relative%3D%221%22%20as%3D%22geometry%22%2F%3E%3C%2FmxCell%3E%3CmxCell%20id%3D%2242%22%20style%3D%22edgeStyle%3DorthogonalEdgeStyle%3Brounded%3D0%3BorthogonalLoop%3D1%3BjettySize%3Dauto%3Bhtml%3D1%3BexitX%3D1%3BexitY%3D0.5%3BexitDx%3D0%3BexitDy%3D0%3BentryX%3D0.647%3BentryY%3D0.99%3BentryDx%3D0%3BentryDy%3D0%3BentryPerimeter%3D0%3B%22%20edge%3D%221%22%20source%3D%2239%22%20target%3D%224%22%20parent%3D%221%22%3E%3CmxGeometry%20relative%3D%221%22%20as%3D%22geometry%22%2F%3E%3C%2FmxCell%3E%3CmxCell%20id%3D%2243%22%20style%3D%22edgeStyle%3DorthogonalEdgeStyle%3Brounded%3D0%3BorthogonalLoop%3D1%3BjettySize%3Dauto%3Bhtml%3D1%3BexitX%3D1%3BexitY%3D0.5%3BexitDx%3D0%3BexitDy%3D0%3BentryX%3D0.954%3BentryY%3D0.998%3BentryDx%3D0%3BentryDy%3D0%3BentryPerimeter%3D0%3B%22%20edge%3D%221%22%20source%3D%2240%22%20target%3D%224%22%20parent%3D%221%22%3E%3CmxGeometry%20relative%3D%221%22%20as%3D%22geometry%22%2F%3E%3C%2FmxCell%3E%3CmxCell%20id%3D%2244%22%20value%3D%22CH340G%22%20style%3D%22rounded%3D0%3BwhiteSpace%3Dwrap%3Bhtml%3D1%3Brotation%3D0%3B%22%20vertex%3D%221%22%20parent%3D%221%22%3E%3CmxGeometry%20x%3D%22349.99999999999994%22%20y%3D%22680%22%20width%3D%2279.69%22%20height%3D%2280%22%20as%3D%22geometry%22%2F%3E%3C%2FmxCell%3E%3CmxCell%20id%3D%2245%22%20value%3D%22%22%20style%3D%22endArrow%3Dclassic%3BstartArrow%3Dclassic%3Bhtml%3D1%3Brounded%3D0%3B%22%20edge%3D%221%22%20parent%3D%221%22%3E%3CmxGeometry%20width%3D%2250%22%20height%3D%2250%22%20relative%3D%221%22%20as%3D%22geometry%22%3E%3CmxPoint%20x%3D%22280%22%20y%3D%22719.66%22%20as%3D%22sourcePoint%22%2F%3E%3CmxPoint%20x%3D%22350%22%20y%3D%22720%22%20as%3D%22targetPoint%22%2F%3E%3C%2FmxGeometry%3E%3C%2FmxCell%3E%3CmxCell%20id%3D%2246%22%20value%3D%22LCD%20TFT%22%20style%3D%22rounded%3D0%3BwhiteSpace%3Dwrap%3Bhtml%3D1%3B%22%20vertex%3D%221%22%20parent%3D%221%22%3E%3CmxGeometry%20x%3D%22450%22%20y%3D%22160%22%20width%3D%22120%22%20height%3D%2280%22%20as%3D%22geometry%22%2F%3E%3C%2FmxCell%3E%3CmxCell%20id%3D%2247%22%20value%3D%22%22%20style%3D%22endArrow%3Dclassic%3BstartArrow%3Dclassic%3Bhtml%3D1%3Brounded%3D0%3BentryX%3D0.25%3BentryY%3D1%3BentryDx%3D0%3BentryDy%3D0%3B%22%20edge%3D%221%22%20target%3D%2246%22%20parent%3D%221%22%3E%3CmxGeometry%20width%3D%2250%22%20height%3D%2250%22%20relative%3D%221%22%20as%3D%22geometry%22%3E%3CmxPoint%20x%3D%22480%22%20y%3D%22320%22%20as%3D%22sourcePoint%22%2F%3E%3CmxPoint%20x%3D%22530%22%20y%3D%22270%22%20as%3D%22targetPoint%22%2F%3E%3C%2FmxGeometry%3E%3C%2FmxCell%3E%3CmxCell%20id%3D%2248%22%20value%3D%22SPI2%22%20style%3D%22rounded%3D0%3BwhiteSpace%3Dwrap%3Bhtml%3D1%3B%22%20vertex%3D%221%22%20parent%3D%221%22%3E%3CmxGeometry%20x%3D%22420%22%20y%3D%22320%22%20width%3D%2270%22%20height%3D%2250%22%20as%3D%22geometry%22%2F%3E%3C%2FmxCell%3E%3C%2Froot%3E%3C%2FmxGraphModel%3E
- Size:
- Date:
- A4
- Number:
- Time:
- Revision:
- Sheet
- of
- ID : 2111370
- File:
- (in symbol FDN340P) S; D; G
- (in symbol LN2302LT1G) D; G; S

### Library data of the parts
C?#1-C?#7 = Cap 0603: Capacitor SMD 0603
D?#2-D?#4 D?#6 = 1N5819W: https://www.thegioiic.com/1n5819w-diode-schottky-1a-40v-sod-123
D?#5 = PSD12C: Package SOD323, Diode TVS, 50 pF, 29.5 V
H? = Header 3P 2.54 Duc Cong: Cắm; Ten_Linh_Kien: Header 3P XH2.54-3P Đực Cong; Don_Vi: Con; Ma_Hang: MH001302; Chung_Loai: Cắm
R?#1 R?#2 = Tro 0603 1% 0R: Dán; Don_Vi: Con; So_Chan: 2; Ten_Linh_Kien: Trở 0603 1% 0R; Ma_Hang: MH005792; Chung_Loai: Dán; Kieu_Chan: *
R?#3 R?#4 = Tro 0603 1% 4.3 k: Dán; Don_Vi: Con; So_Chan: 2; Ten_Linh_Kien: Trở 0603 1% 4.3k; Ma_Hang: MH008715; Chung_Loai: Dán; Kieu_Chan: *
R?#5 = Tro 0603 1% 1k: Dán; So_Chan: 2; Don_Vi: Con; Ten_Linh_Kien: Trở 0603 1% 1k; Ma_Hang: MH006334; Chung_Loai: Dán; Kieu_Chan: *
R?#6-R?#11 = Tro 0603 1% 10k: Dán; Don_Vi: Con; So_Chan: 2; Ten_Linh_Kien: Trở 0603 1% 10k; Ma_Hang: MH006333; Chung_Loai: Dán; Kieu_Chan: *
SW? = But_ngang: https://www.thegioiic.com/nut-nhan-3x6mm-cao-3-5mm-4-chan-smd-chinh-ngang
U?#1 = SMF05C: https://www.thegioiic.com/products?search=smf05
U?#2 = USB TYPE C 16PIN: https://www.thegioiic.com/cong-usb-cai-3-1-type-c-16-chan-thang-dan-smd

## Sheet CONTROL POWER.SchDoc
size A; SheetNumber: 3; SheetTotal: 3

## Sheet POWER_MEASUREMENT.SchDoc
size A; SheetNumber: 6; SheetTotal: 15

## Sheet 4_20mA_Conv.SchDoc
size A3; SheetNumber: 7; SheetTotal: 15
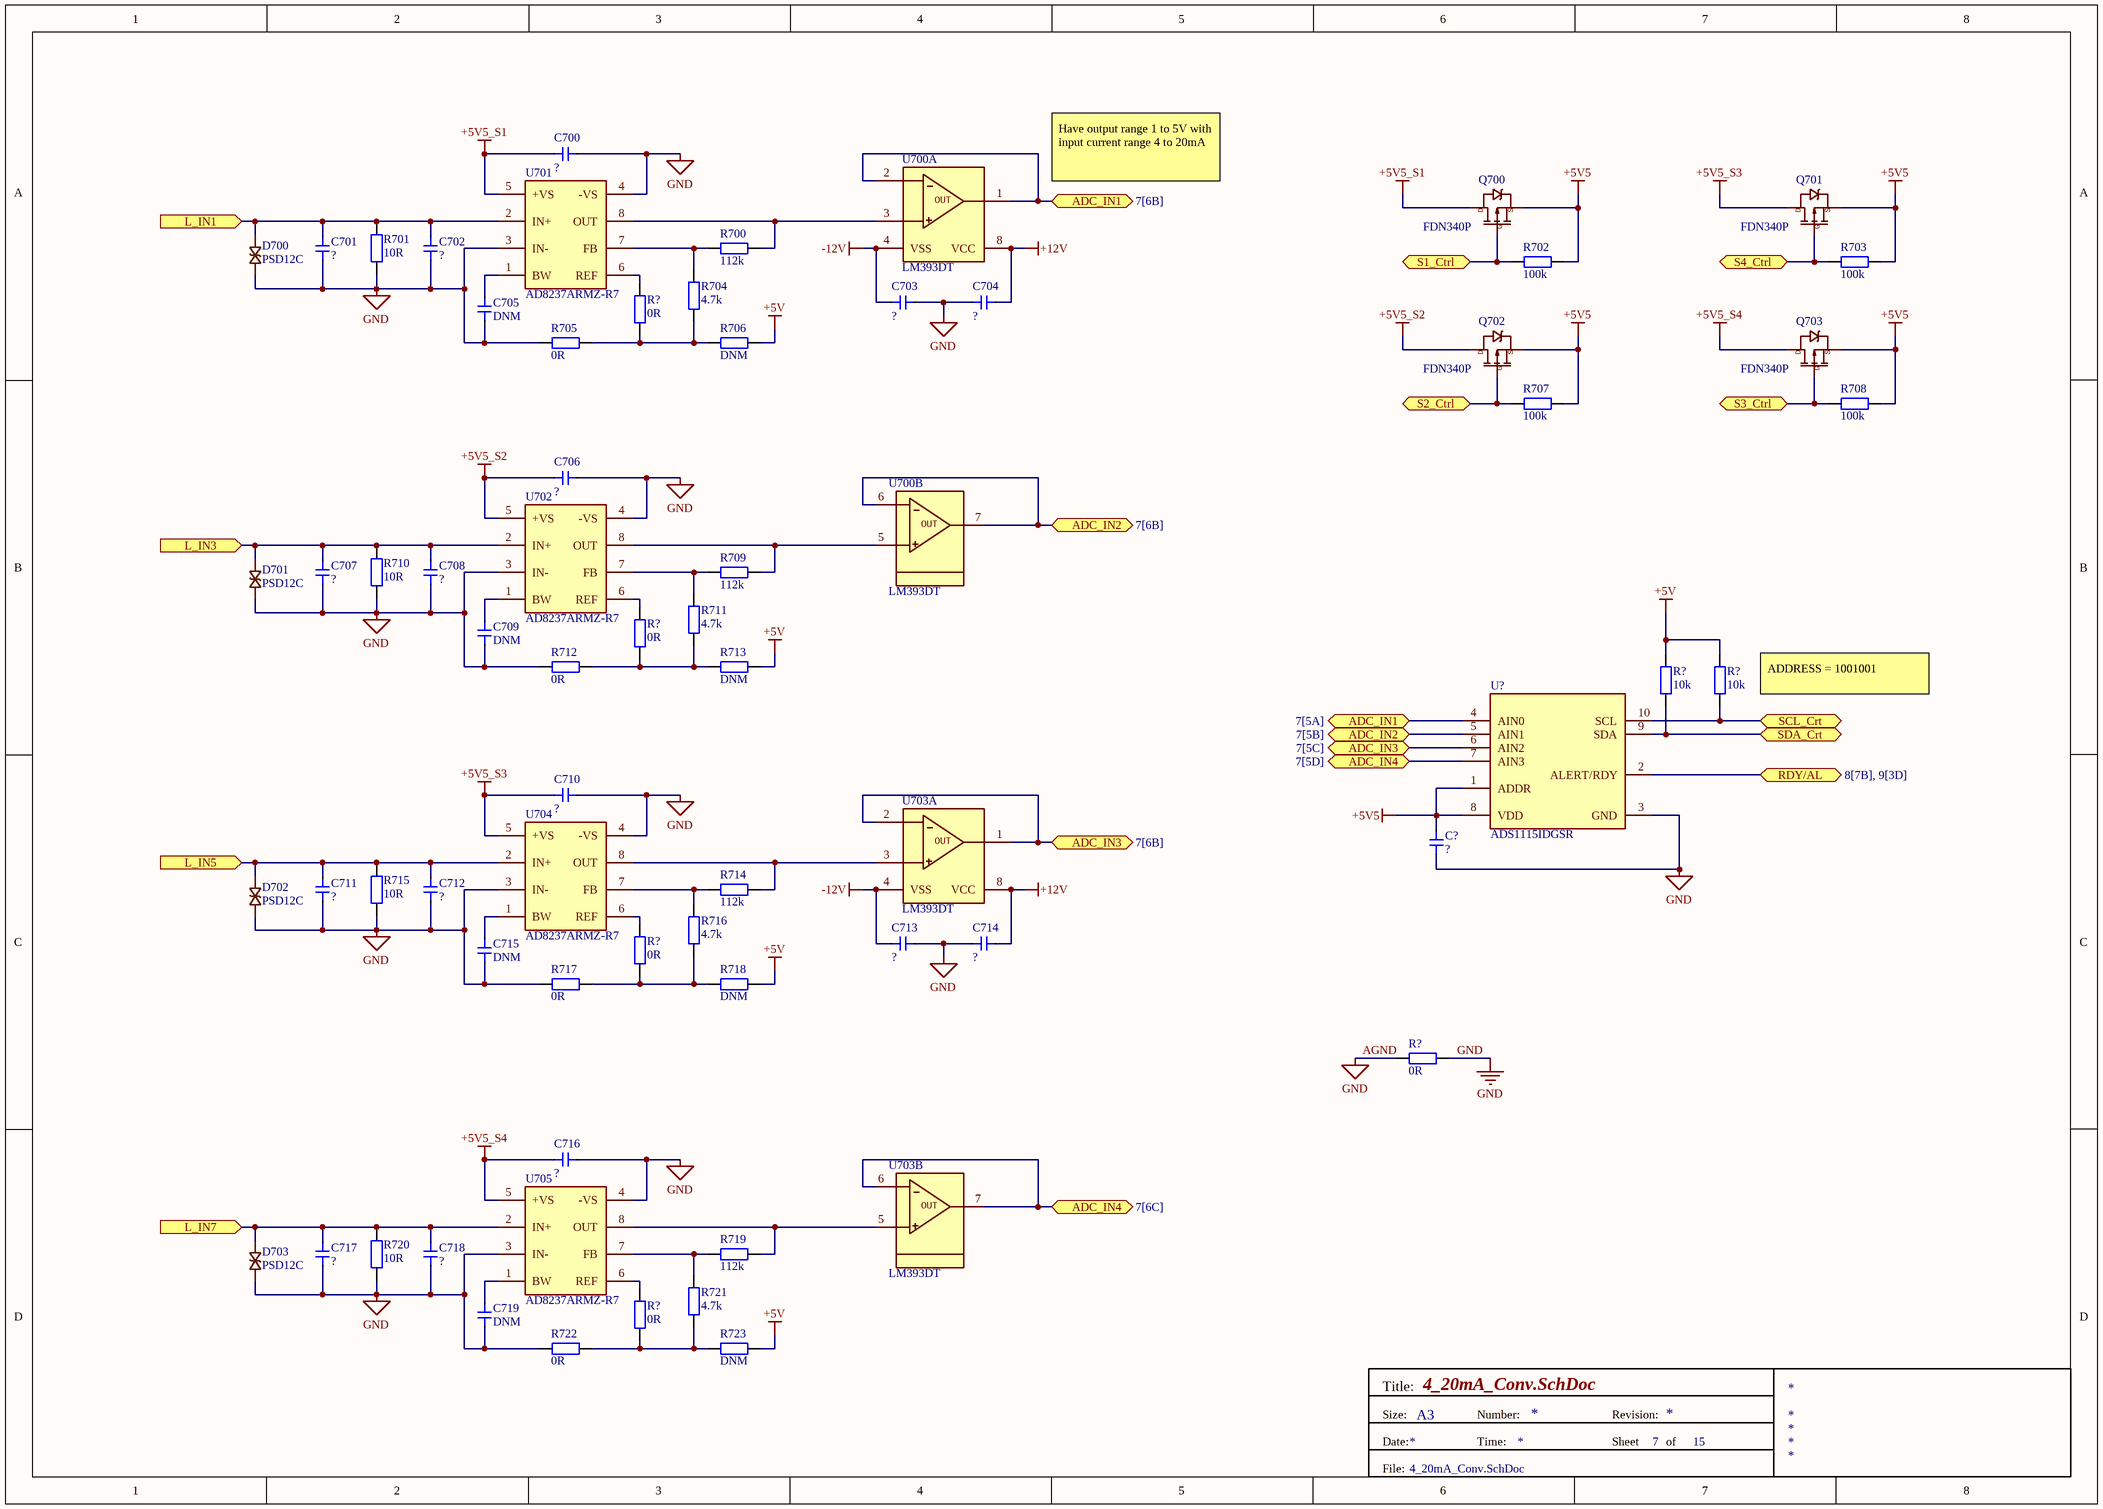
[diagram p4: 4_20mA_Conv.SchDoc]

### Parts
(Parts that share a designator on the sheet are numbered #1, #2 ... from top to bottom, then left to right.)
C700  ?  [Cap 0603]
C701  ?  [Cap 0603]
C702  ?  [Cap 0603]
C703  ?  [Cap 0603]
C704  ?  [Cap 0603]
C705  DNM  [Cap 0603]
C706  ?  [Cap 0603]
C707  ?  [Cap 0603]
C708  ?  [Cap 0603]
C709  DNM  [Cap 0603]
C710  ?  [Cap 0603]
C711  ?  [Cap 0603]
C712  ?  [Cap 0603]
C713  ?  [Cap 0603]
C714  ?  [Cap 0603]
C715  DNM  [Cap 0603]
C716  ?  [Cap 0603]
C717  ?  [Cap 0603]
C718  ?  [Cap 0603]
C719  DNM  [Cap 0603]
C?#8  ?  [Cap 0603]
D700  PSD12C  [SOD-323]
D701  PSD12C  [SOD-323]
D702  PSD12C  [SOD-323]
D703  PSD12C  [SOD-323]
Q700  FDN340P  [FDN340P]
Q701  FDN340P  [FDN340P]
Q702  FDN340P  [FDN340P]
Q703  FDN340P  [FDN340P]
R700  112k  [Tro smd 0603]
R701  10R  [tro smd 0603]
R702  100k  [tro smd 0603]
R703  100k  [tro smd 0603]
R704  4.7k  [tro smd 0603]
R705  0R  [tro smd 0603]
R706  DNM  [tro smd 0603]
R707  100k  [tro smd 0603]
R708  100k  [tro smd 0603]
R709  112k  [Tro smd 0603]
R710  10R  [tro smd 0603]
R711  4.7k  [tro smd 0603]
R712  0R  [tro smd 0603]
R713  DNM  [tro smd 0603]
R714  112k  [Tro smd 0603]
R715  10R  [tro smd 0603]
R716  4.7k  [tro smd 0603]
R717  0R  [tro smd 0603]
R718  DNM  [tro smd 0603]
R719  112k  [Tro smd 0603]
R720  10R  [tro smd 0603]
R721  4.7k  [tro smd 0603]
R722  0R  [tro smd 0603]
R723  DNM  [tro smd 0603]
R?#12  0R  [tro smd 0603]
R?#13  0R  [tro smd 0603]
R?#14  10k  [tro smd 0603]
R?#15  10k  [tro smd 0603]
R?#16  0R  [tro smd 0603]
R?#17  0R  [tro smd 0603]
R?#18  0R  [tro smd 0603]
U700  LM393DT  [SOIC8]  (parts A,B of 2)
U701  AD8237ARMZ-R7  [AD8237ARMZ-R7]
U702  AD8237ARMZ-R7  [AD8237ARMZ-R7]
U703  LM393DT  [SOIC8]  (parts A,B of 2)
U704  AD8237ARMZ-R7  [AD8237ARMZ-R7]
U705  AD8237ARMZ-R7  [AD8237ARMZ-R7]
U?#3  ADS1115IDGSR  [AD8237ARMZ-R7]

### Ports
ADC_IN1 (bidir, see 7[5A]), ADC_IN1 (bidir, see 7[6B]), ADC_IN2 (bidir, see 7[5B]), ADC_IN2 (bidir, see 7[6B]), ADC_IN3 (bidir, see 7[5C]), ADC_IN3 (bidir, see 7[6B]), ADC_IN4 (bidir, see 7[5D]), ADC_IN4 (bidir, see 7[6C]), L_IN1 (in), L_IN3 (in), L_IN5 (in), L_IN7 (in), RDY/AL (bidir, see 8[7B], 9[3D]), S1_Ctrl (bidir), S2_Ctrl (bidir), S3_Ctrl (bidir), S4_Ctrl (bidir), SCL_Crt (bidir), SDA_Crt (bidir)

### Nets
+5V: R706.1 R713.1 R718.1 R723.1 R?#14.2 R?#15.2
+5V5: C?#8.2 Q700.2 Q701.2 Q702.2 Q703.2 R702.2 R703.2 R707.2 R708.2 U?#3.1(ADDR) U?#3.8(VDD)
+5V5_S1: C700.1 Q700.3 U701.5(+VS)
+5V5_S2: C706.1 Q702.3 U702.5(+VS)
+5V5_S3: C710.1 Q701.3 U704.5(+VS)
+5V5_S4: C716.1 Q703.3 U705.5(+VS)
+12V: C704.2 C714.2 U700.8(VCC) U703.8(VCC)
-12V: C703.1 C713.1 U700.4(VSS) U703.4(VSS)
AGND: C700.2 C701.2 C702.2 C703.2 C704.1 C705.2 C706.2 C707.2 C708.2 C709.2 C710.2 C711.2 C712.2 C713.2 C714.1 C715.2 C716.2 C717.2 C718.2 C719.2 C?#8.1 D700.A D701.A D702.A D703.A R701.1 R705.2 R710.1 R712.2 R715.1 R717.2 R720.1 R722.2 R?#17.1 R?#17.2 U701.3(IN-) U701.4(-VS) U702.3(IN-) U702.4(-VS) U704.3(IN-) U704.4(-VS) U705.3(IN-) U705.4(-VS) U?#3.3(GND)  [also labelled GND]
NetC701_1: C701.1 C702.1 D700.C R701.2 U701.2(IN+) ; port L_IN1
NetC705_1: C705.1 U701.1(BW)
NetC707_1: C707.1 C708.1 D701.C R710.2 U702.2(IN+) ; port L_IN3
NetC709_1: C709.1 U702.1(BW)
NetC711_1: C711.1 C712.1 D702.C R715.2 U704.2(IN+) ; port L_IN5
NetC715_1: C715.1 U704.1(BW)
NetC717_1: C717.1 C718.1 D703.C R720.2 U705.2(IN+) ; port L_IN7
NetC719_1: C719.1 U705.1(BW)
NetQ700_1: Q700.1 R702.1 ; port S1_Ctrl
NetQ701_1: Q701.1 R703.1 ; port S4_Ctrl
NetQ702_1: Q702.1 R707.1 ; port S2_Ctrl
NetQ703_1: Q703.1 R708.1 ; port S3_Ctrl
NetR700_1: R700.1 R704.2 U701.7(FB)
NetR700_2: R700.2 U700.3 U701.8(OUT)
NetR704_1: R704.1 R705.1 R706.2 R?#12.2
NetR709_1: R709.1 R711.2 U702.7(FB)
NetR709_2: R709.2 U700.5 U702.8(OUT)
NetR711_1: R711.1 R712.1 R713.2 R?#13.2
NetR714_1: R714.1 R716.2 U704.7(FB)
NetR714_2: R714.2 U703.3 U704.8(OUT)
NetR716_1: R716.1 R717.1 R718.2 R?#16.2
NetR719_1: R719.1 R721.2 U705.7(FB)
NetR719_2: R719.2 U703.5 U705.8(OUT)
NetR721_1: R721.1 R722.1 R723.2 R?#18.2
NetR?#12_1: R?#12.1 U701.6(REF)
NetR?#13_1: R?#13.1 U702.6(REF)
NetR?#14_1: R?#14.1 U?#3.9(SDA) ; port SDA_Crt
NetR?#15_1: R?#15.1 U?#3.10(SCL) ; port SCL_Crt
NetR?#16_1: R?#16.1 U704.6(REF)
NetR?#18_1: R?#18.1 U705.6(REF)
NetU700_1: U700.1 U700.2 U?#3.4(AIN0) ; port ADC_IN1
NetU700_6: U700.6 U700.7 U?#3.5(AIN1) ; port ADC_IN2
NetU703_1: U703.1 U703.2 U?#3.6(AIN2) ; port ADC_IN3
NetU703_6: U703.6 U703.7 U?#3.7(AIN3) ; port ADC_IN4
NetU?#3_2: U?#3.2(ALERT/RDY) ; port RDY/AL

### Notes on the sheet
- Have output range 1 to 5V with input current range 4 to 20mA
- (near R?#15) ADDRESS = 1001001
- Title:
- Size:
- Date:
- A3
- Number:
- Time:
- Revision:
- Sheet
- of
- File:
- (in symbol FDN340P) D; S; G
- (in symbol LM393DT, part A) OUT
- (in symbol LM393DT, part B) OUT

### Library data of the parts
C700-C719 C?#8 = Cap 0603: Capacitor SMD 0603
D700-D703 = PSD12C: Package SOD323, Diode TVS, 50 pF, 29.5 V
R700 R709 R714 R719 = Tro 0603 1% 33k: Dán; Don_Vi: Con; So_Chan: 2; Ten_Linh_Kien: Trở 0603 1% 33k; Ma_Hang: MH006335; Chung_Loai: Dán; Kieu_Chan: *
R701 R710 R715 R720 = Tro 0603 1% 1R: Dán; Don_Vi: Con; So_Chan: 2; Ten_Linh_Kien: Trở 0603 1% 1R; Ma_Hang: MH007007; Chung_Loai: Dán; Kieu_Chan: *
R702 R703 R707 R708 = Tro 0603 5% 100k: Dán; So_Chan: 2; Ten_Linh_Kien: Trở 0603 5% 100k; Ma_Hang: MH006314; Don_Vi: Con; Chung_Loai: Dán; Kieu_Chan: *
R704 R711 R716 R721 = Tro 0603 5% 4.7k: Dán; Don_Vi: Con; So_Chan: 2; Ten_Linh_Kien: Trở 0603 5% 4.7k; Ma_Hang: MH006327; Chung_Loai: Dán; Kieu_Chan: *
R705 R706 R712 R713 R717 R718 R722 R723 R?#12 R?#13 R?#16-R?#18 = Tro 0603 1% 0R: as R?#1 on sheet SOURCE POWER; Chung_Loai: Dán; Kieu_Chan: *
R?#14 R?#15 = Tro 0603 1% 10k: as R?#6 on sheet SOURCE POWER; Chung_Loai: Dán; Kieu_Chan: *
U700 U703 = LM393DT: Điện áp: 2V ~ 36V, ± 1V ~ 18V, Số chân: 8
U701 U702 U704 U705 = AD8237ARMZ-R7: Instrumentation Amplifier, 1 Func, 75uV Offset-Max, 0.2MHz Band Width, CMOS, PDSO8; Manufacturer: Analog Devices; Package Body Material: Plastic; Channels: 1; Package Equivalence Code: TSSOP8,.19; Power Supplies: 5V; Max Supply Current: 150uA; Qualification Status: Not Qualified; Supplier: Digikey; Supplier Part Number: AD8237ARMZ-R7CT-ND; Manufacturer Part Number: AD8237ARMZ-R7; RoHS: Yes; Category: Amplifiers - Op Amps, Buffer, Instrumentation; Stock: 5371; Pricing: 1=4.34, 10=2.871, 25=2.4888, 100=2.06, 250=1.8516, 500=1.72446 (USD); Case/Package: TSSOP; Pins: 8; Package Shape: Rectangular; Terminal Finish: Tin; Min Operating Temperature: -40°C; Max Operating Temperature: 125°C; JESD-609 Code: e3; Amplifier Type: INSTRUMENTATION AMPLIFIER; JESD-30 Code: R-PDSO-G8; Moisture Sensitivity Level: 1; Package Style: SMALL OUTLINE, THIN PROFILE, SHRINK PITCHMeter; Nominal Supply Voltage: 5V; Surface Mount: Yes; Technology: CMOS; Terminal Form: Gull Wing; Terminal Position: DUAL; Terminal Pitch: 0.635mm; Temperature Grade: AUTOMOTIVE; Reach SVHC Compliant: Yes; RoHS Compliant: Yes; ComponentLink1URL: https://datasheet.ciiva.com:443/pdfs/VipMasterIC/IC/ANDI/ANDIS13412/ANDIS13412-1.pdf?src-supplier=IHS+Markit; ComponentLink1Description: https://datasheet.ciiva.com:443/pdfs/VipMasterIC/IC/ANDI/ANDIS13412/ANDIS13412-1.pdf?src-supplier=IHS+Markit; ComponentLink2URL: https://datasheet.ciiva.com/6626/ad8237-6626733.pdf?src-supplier=Digikey; ComponentLink2Description: https://datasheet.ciiva.com/6626/ad8237-6626733.pdf?src-supplier=Digikey; ComponentLink3URL: https://datasheet.ciiva.com/8582/ad8237-8582303.pdf?src-supplier=Avnet; ComponentLink3Description: https://datasheet.ciiva.com/8582/ad8237-8582303.pdf?src-supplier=Avnet
U?#3 = ADS1115IDGSR: ADC, Delta-Sigma, 16-Bit, 1 Func, 4 Channel, Serial Access, PDSO10; Manufacturer: Texas Instruments; Package Body Material: Plastic; Max Input Voltage (AC): 4.096V; Min Input Voltage (AC): -4.096V; Conversion Time-Max: 1.162us; Linearity Error-Max (EL): 0.0015%; Number of Analog In Channels: 4; Number of Bits: 16; Channels: 1; Output Bit Code: 2''S COMPLEMENT BINARY; Package Equivalence Code: TSSOP10,.19,20; Power Supplies: 3.3V; Sample Rate (Hz): 860kHz; Qualification Status: Not Qualified; Supplier: Digikey; Supplier Part Number: 296-38849-1-ND; Manufacturer Part Number: ADS1115IDGSR; RoHS: Yes; Category: Analog to Digital Converters (ADCs); Stock: 3443; Pricing: 1=4.96, 10=3.644, 25=3.3144, 100=2.952, 250=2.77904, 500=2.67478, 1000=2.58892 (USD); Case/Package: TSSOP; Pins: 10; Package Shape: Square; Terminal Finish: Nickel; Min Operating Temperature: -40°C; Max Operating Temperature: 125°C; JESD-609 Code: e4; Output Format: Serial; Converter Type: DELTA-SIGMA; JESD-30 Code: S-PDSO-G10; Moisture Sensitivity Level: 2; Package Style: SMALL OUTLINE, THIN PROFILE, SHRINK PITCHMeter; Peak Reflow Temperature (Cel): 260°C; Nominal Supply Voltage: 3.3V; Surface Mount: Yes; Terminal Form: Gull Wing; Terminal Position: DUAL; Length: 3mm; Width: 3mm; Height - Seated (Max): 1.1mm; Terminal Pitch: 0.5mm; Temperature Grade: AUTOMOTIVE; Reach SVHC Compliant: Yes; RoHS Compliant: Yes; ComponentLink1URL: https://www.ti.com:443/lit/ds/symlink/ads1113.pdf?src-supplier=IHS+Markit; ComponentLink1Description: https://www.ti.com:443/lit/ds/symlink/ads1113.pdf?src-supplier=IHS+Markit; ComponentLink2URL: https://datasheet.ciiva.com/4031/47725463s8438921n7713-4031028.pdf?src-supplier=Arrow+Electronics; ComponentLink2Description: https://datasheet.ciiva.com/4031/47725463s8438921n7713-4031028.pdf?src-supplier=Arrow+Electronics

## Sheet 0_10V_Conv.SchDoc
size A3; SheetNumber: 8; SheetTotal: 15
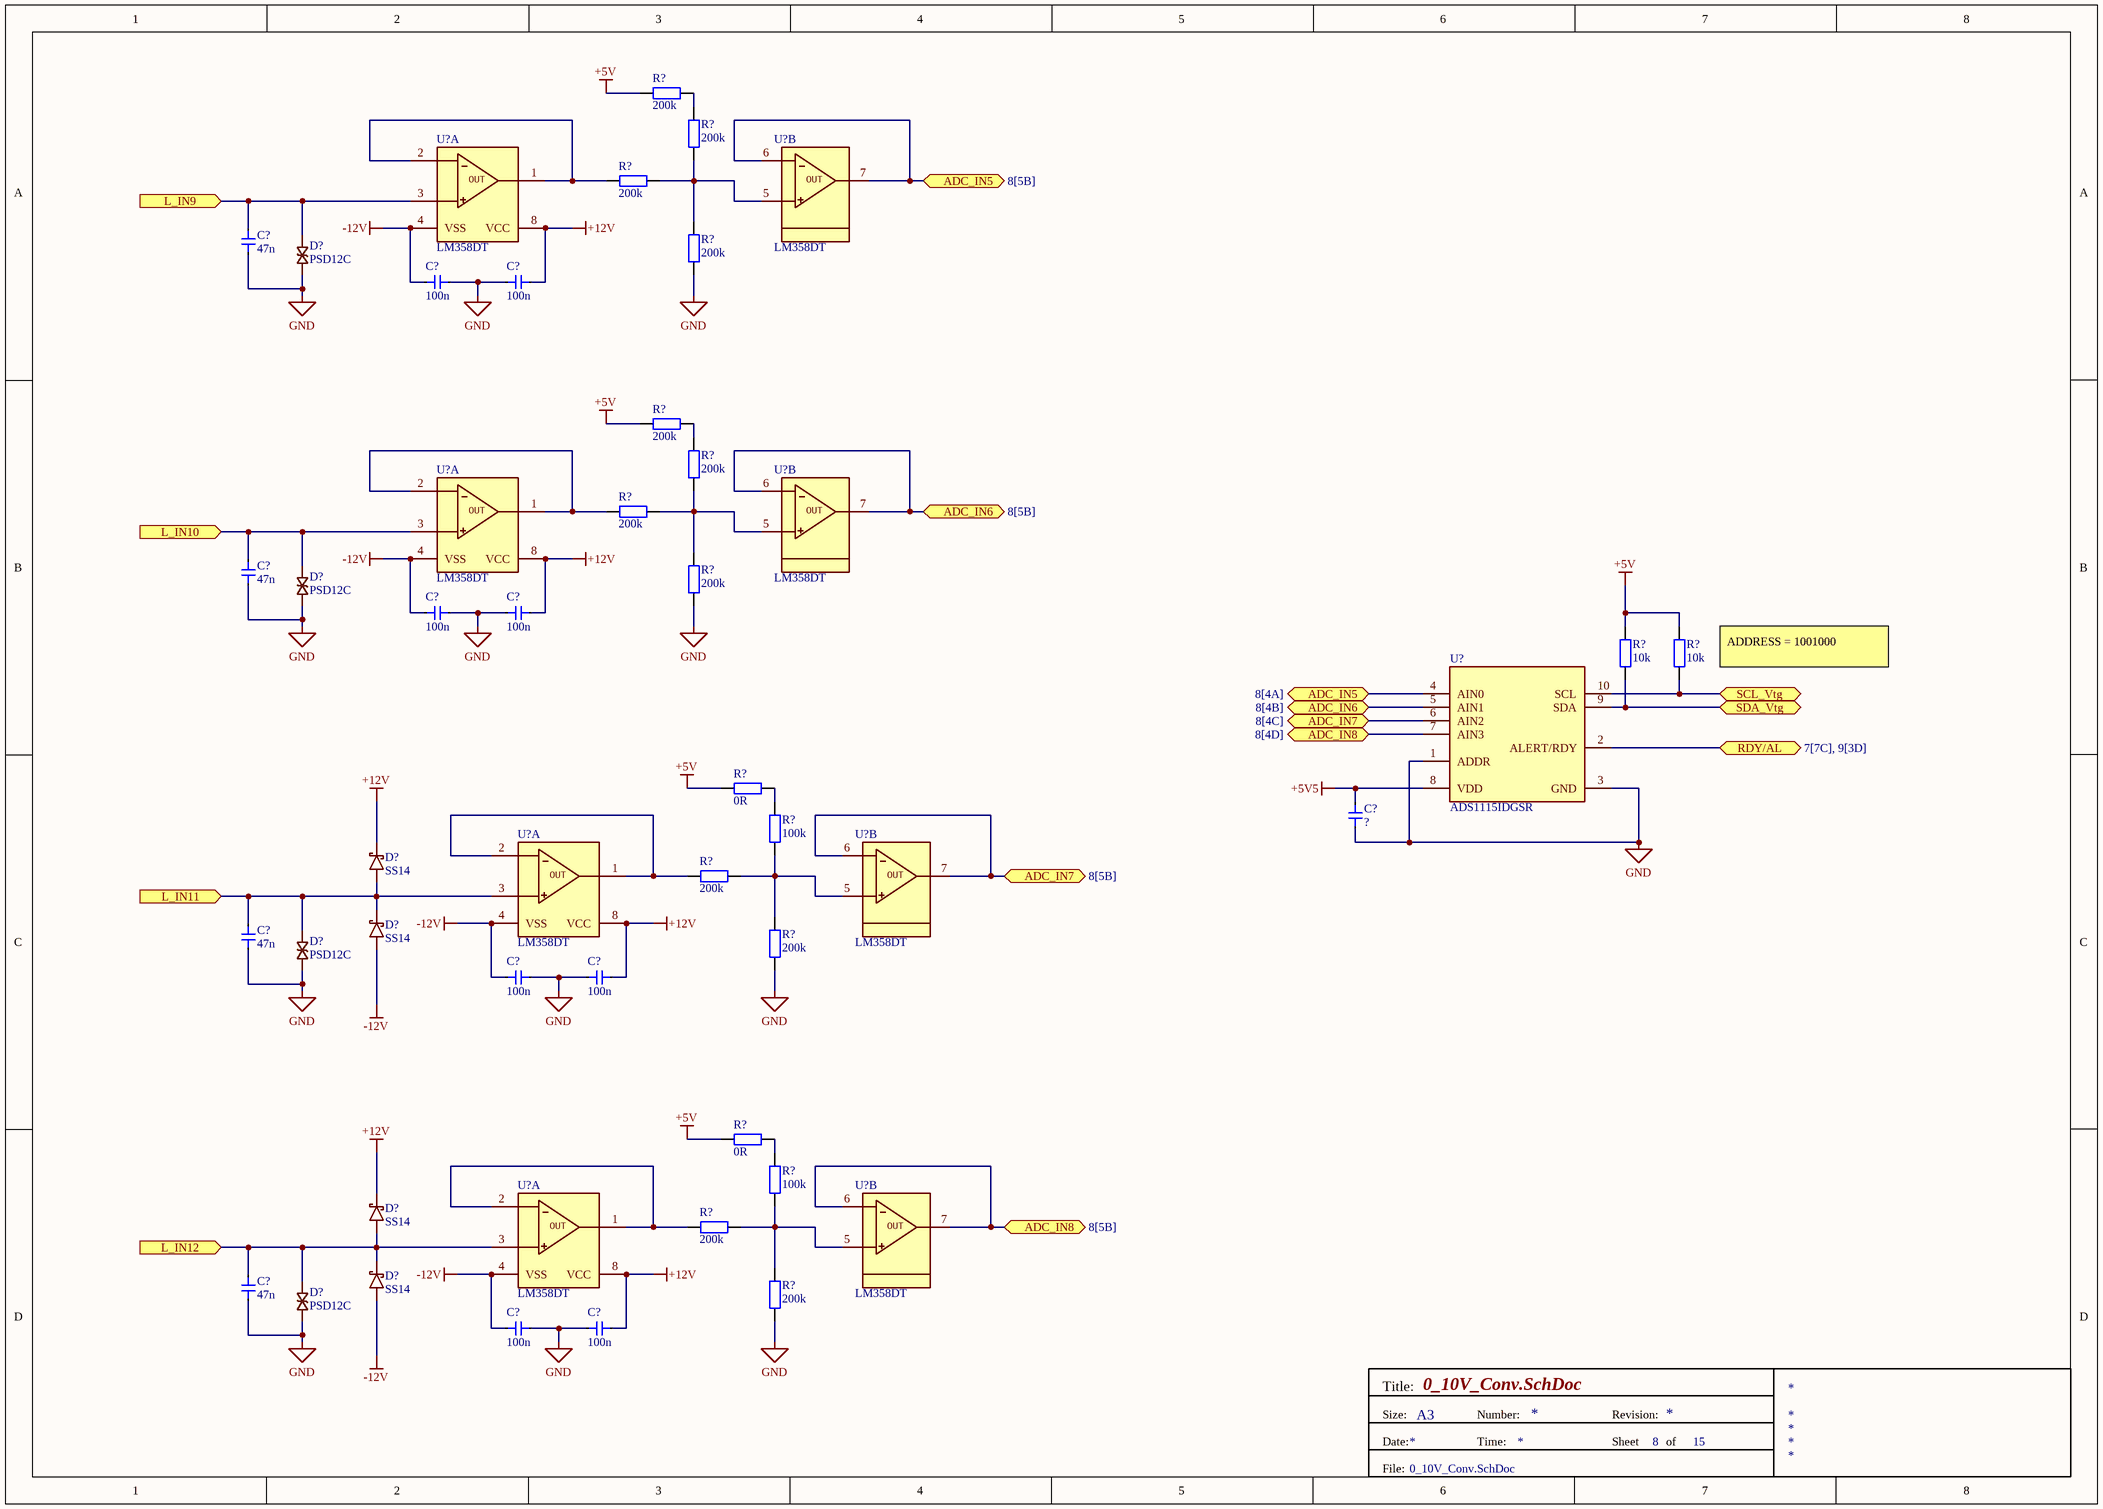
[diagram p5: 0_10V_Conv.SchDoc]

### Parts
(Parts that share a designator on the sheet are numbered #1, #2 ... from top to bottom, then left to right.)
C?#9  47n  [Cap 0603]
C?#10  100n  [Cap 0603]
C?#11  100n  [Cap 0603]
C?#12  47n  [Cap 0603]
C?#13  100n  [Cap 0603]
C?#14  100n  [Cap 0603]
C?#15  ?  [Cap 0603]
C?#16  47n  [Cap 0603]
C?#17  100n  [Cap 0603]
C?#18  100n  [Cap 0603]
C?#19  47n  [Cap 0603]
C?#20  100n  [Cap 0603]
C?#21  100n  [Cap 0603]
D?#7  PSD12C  [SOD-323]
D?#8  PSD12C  [SOD-323]
D?#9  SS14  [SS14]
D?#10  SS14  [SS14]
D?#11  PSD12C  [SOD-323]
D?#12  SS14  [SS14]
D?#13  SS14  [SS14]
D?#14  PSD12C  [SOD-323]
R?#19  200k  [tro smd 0603]
R?#20  200k  [tro smd 0603]
R?#21  200k  [tro smd 0603]
R?#22  200k  [tro smd 0603]
R?#23  200k  [tro smd 0603]
R?#24  200k  [tro smd 0603]
R?#25  200k  [tro smd 0603]
R?#26  200k  [tro smd 0603]
R?#27  10k  [tro smd 0603]
R?#28  10k  [tro smd 0603]
R?#29  0R  [tro smd 0603]
R?#30  100k  [tro smd 0603]
R?#31  200k  [tro smd 0603]
R?#32  200k  [tro smd 0603]
R?#33  0R  [tro smd 0603]
R?#34  100k  [tro smd 0603]
R?#35  200k  [tro smd 0603]
R?#36  200k  [tro smd 0603]
U?#4  LM358DT  [SOIC8]  (part A of 2)
U?#5  LM358DT  [SOIC8]  (part B of 2)
U?#6  LM358DT  [SOIC8]  (part A of 2)
U?#7  LM358DT  [SOIC8]  (part B of 2)
U?#8  ADS1115IDGSR  [AD8237ARMZ-R7]
U?#9  LM358DT  [SOIC8]  (part A of 2)
U?#10  LM358DT  [SOIC8]  (part B of 2)
U?#11  LM358DT  [SOIC8]  (part A of 2)
U?#12  LM358DT  [SOIC8]  (part B of 2)

### Ports
ADC_IN5 (bidir, see 8[4A]), ADC_IN5 (bidir, see 8[5B]), ADC_IN6 (bidir, see 8[4B]), ADC_IN6 (bidir, see 8[5B]), ADC_IN7 (bidir, see 8[4C]), ADC_IN7 (bidir, see 8[5B]), ADC_IN8 (bidir, see 8[4D]), ADC_IN8 (bidir, see 8[5B]), L_IN9 (in), L_IN10 (in), L_IN11 (in), L_IN12 (in), RDY/AL (bidir, see 7[7C], 9[3D]), SCL_Vtg (bidir), SDA_Vtg (bidir)

### Nets
+5V: R?#19.1 R?#23.1 R?#27.2 R?#28.2 R?#29.1 R?#33.1
+5V5: C?#15.2 U?#8.8(VDD)
+12V: C?#11.2 C?#14.2 C?#18.2 C?#21.2 D?#9.2 D?#12.2 U?#4.8(VCC) U?#6.8(VCC) U?#9.8(VCC) U?#11.8(VCC)
-12V: C?#10.1 C?#13.1 C?#17.1 C?#20.1 D?#10.1 D?#13.1 U?#4.4(VSS) U?#6.4(VSS) U?#9.4(VSS) U?#11.4(VSS)
GND: C?#9.2 C?#10.2 C?#11.1 C?#12.2 C?#13.2 C?#14.1 C?#15.1 C?#16.2 C?#17.2 C?#18.1 C?#19.2 C?#20.2 C?#21.1 D?#7.A D?#8.A D?#11.A D?#14.A R?#22.2 R?#26.2 R?#32.2 R?#36.2 U?#8.1(ADDR) U?#8.3(GND)  [project net AGND]
NetC?#9_1: C?#9.1 D?#7.C U?#4.3 ; port L_IN9
NetC?#12_1: C?#12.1 D?#8.C U?#6.3 ; port L_IN10
NetC?#16_1: C?#16.1 D?#9.1 D?#10.2 D?#11.C U?#9.3 ; port L_IN11
NetC?#19_1: C?#19.1 D?#12.1 D?#13.2 D?#14.C U?#11.3 ; port L_IN12
NetR?#19_2: R?#19.2 R?#20.1
NetR?#20_2: R?#20.2 R?#21.2 R?#22.1 U?#5.5
NetR?#21_1: R?#21.1 U?#4.1 U?#4.2
NetR?#23_2: R?#23.2 R?#24.1
NetR?#24_2: R?#24.2 R?#25.2 R?#26.1 U?#7.5
NetR?#25_1: R?#25.1 U?#6.1 U?#6.2
NetR?#27_1: R?#27.1 U?#8.9(SDA) ; port SDA_Vtg
NetR?#28_1: R?#28.1 U?#8.10(SCL) ; port SCL_Vtg
NetR?#29_2: R?#29.2 R?#30.1
NetR?#30_2: R?#30.2 R?#31.2 R?#32.1 U?#10.5
NetR?#31_1: R?#31.1 U?#9.1 U?#9.2
NetR?#33_2: R?#33.2 R?#34.1
NetR?#34_2: R?#34.2 R?#35.2 R?#36.1 U?#12.5
NetR?#35_1: R?#35.1 U?#11.1 U?#11.2
NetU?#3_2: U?#8.2(ALERT/RDY) ; port RDY/AL
NetU?#5_6: U?#5.6 U?#5.7 U?#8.4(AIN0) ; port ADC_IN5
NetU?#7_6: U?#7.6 U?#7.7 U?#8.5(AIN1) ; port ADC_IN6
NetU?#8_6: U?#8.6(AIN2) U?#10.6 U?#10.7 ; port ADC_IN7
NetU?#8_7: U?#8.7(AIN3) U?#12.6 U?#12.7 ; port ADC_IN8

### Notes on the sheet
- (near R?#28) ADDRESS = 1001000
- Title:
- Size:
- Date:
- A3
- Number:
- Time:
- Revision:
- Sheet
- of
- File:
- (in symbol LM358DT, part A) OUT
- (in symbol LM358DT, part B) OUT

### Library data of the parts
C?#9-C?#21 = Cap 0603: Capacitor SMD 0603
D?#7 D?#8 D?#11 D?#14 = PSD12C: Package SOD323, Diode TVS, 50 pF, 29.5 V
R?#19-R?#36 = Tro 0603 1% 10k: as R?#6 on sheet SOURCE POWER; Chung_Loai: Dán; Kieu_Chan: *
U?#4-U?#7 U?#9-U?#12 = LM358DT: Điện áp: 2V ~ 36V, ± 1V ~ 18V, Số chân: 8
U?#8 = ADS1115IDGSR: as U?#3 on sheet 4_20mA_Conv; Supplier: Digikey; Supplier Part Number: 296-38849-1-ND; Manufacturer Part Number: ADS1115IDGSR; RoHS: Yes; Category: Analog to Digital Converters (ADCs); Stock: 3443; Pricing: 1=4.96, 10=3.644, 25=3.3144, 100=2.952, 250=2.77904, 500=2.67478, 1000=2.58892 (USD); Case/Package: TSSOP; Pins: 10; Package Shape: Square; Terminal Finish: Nickel; Min Operating Temperature: -40°C; Max Operating Temperature: 125°C; JESD-609 Code: e4; Output Format: Serial; Converter Type: DELTA-SIGMA; JESD-30 Code: S-PDSO-G10; Moisture Sensitivity Level: 2; Package Style: SMALL OUTLINE, THIN PROFILE, SHRINK PITCHMeter; Peak Reflow Temperature (Cel): 260°C; Nominal Supply Voltage: 3.3V; Surface Mount: Yes; Terminal Form: Gull Wing; Terminal Position: DUAL; Length: 3mm; Width: 3mm; Height - Seated (Max): 1.1mm; Terminal Pitch: 0.5mm; Temperature Grade: AUTOMOTIVE; Reach SVHC Compliant: Yes; RoHS Compliant: Yes; ComponentLink1URL: https://www.ti.com:443/lit/ds/symlink/ads1113.pdf?src-supplier=IHS+Markit; ComponentLink1Description: https://www.ti.com:443/lit/ds/symlink/ads1113.pdf?src-supplier=IHS+Markit; ComponentLink2URL: https://datasheet.ciiva.com/4031/47725463s8438921n7713-4031028.pdf?src-supplier=Arrow+Electronics; ComponentLink2Description: https://datasheet.ciiva.com/4031/47725463s8438921n7713-4031028.pdf?src-supplier=Arrow+Electronics

## Sheet SPECIAL_INPUT.SchDoc
size A4; SheetNumber: 9; SheetTotal: 15
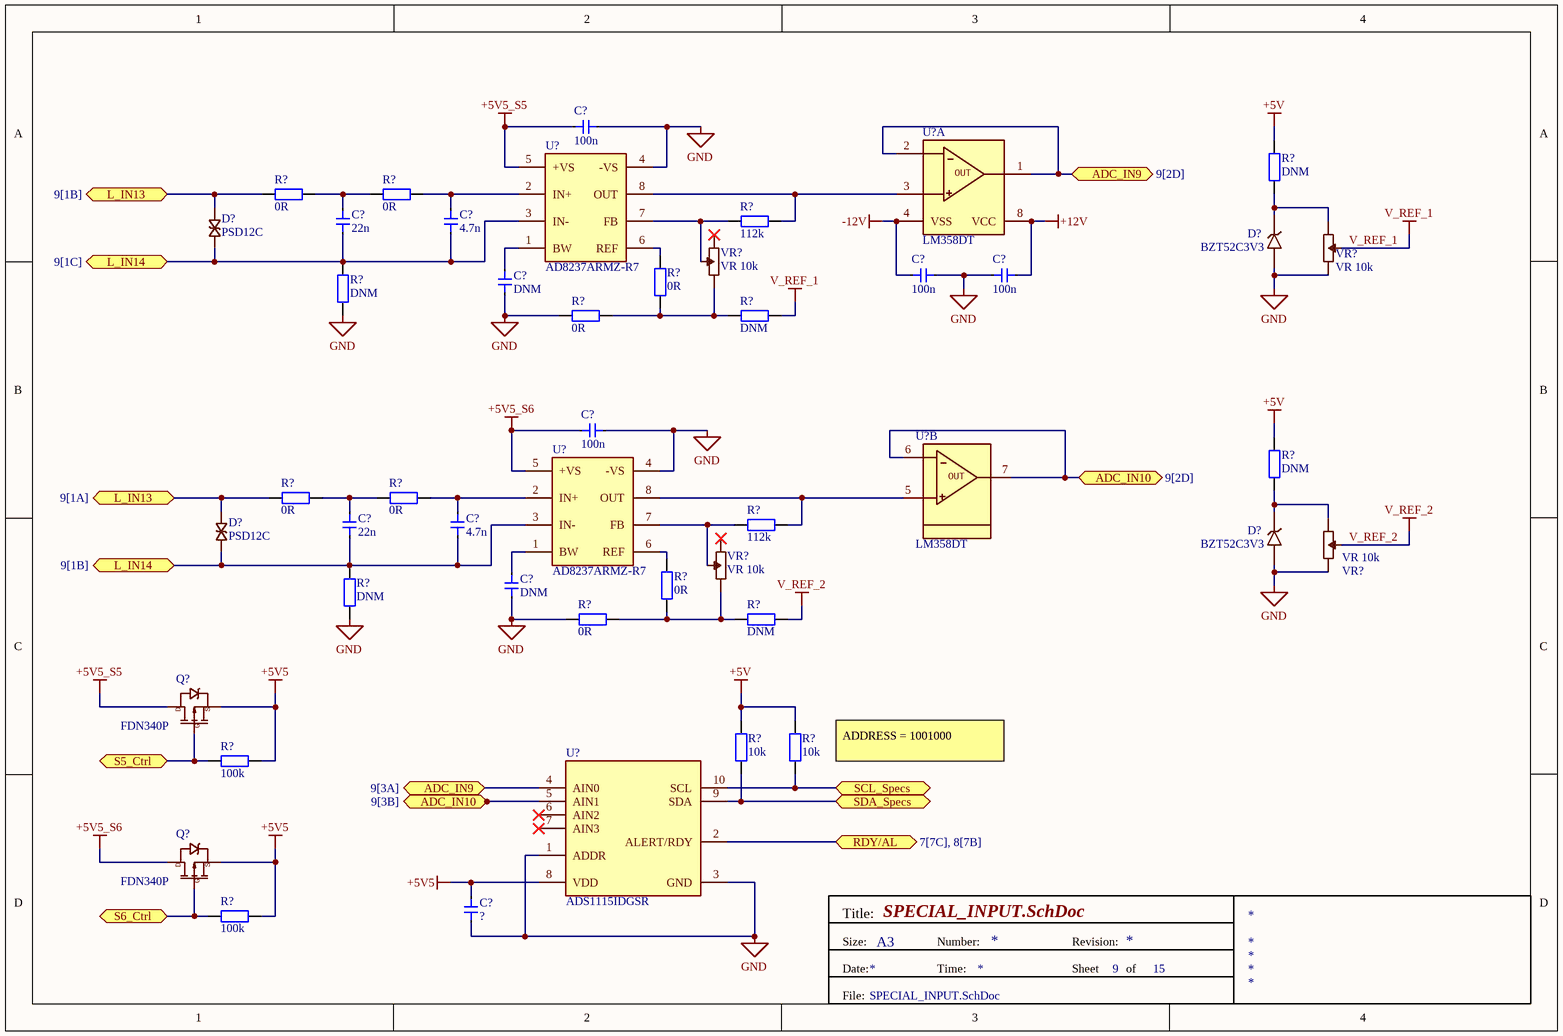
[diagram p6: SPECIAL_INPUT.SchDoc]

### Parts
(Parts that share a designator on the sheet are numbered #1, #2 ... from top to bottom, then left to right.)
C?#22  100n  [Cap 0603]
C?#23  22n  [Cap 0603]
C?#24  4.7n  [Cap 0603]
C?#25  100n  [Cap 0603]
C?#26  100n  [Cap 0603]
C?#27  DNM  [Cap 0603]
C?#28  100n  [Cap 0603]
C?#29  22n  [Cap 0603]
C?#30  4.7n  [Cap 0603]
C?#31  DNM  [Cap 0603]
C?#32  ?  [Cap 0603]
D?#15  PSD12C  [SOD-323]
D?#16  BZT52C3V3  [SOD-123F]
D?#17  PSD12C  [SOD-323]
D?#18  BZT52C3V3  [SOD-123F]
Q?#6  FDN340P  [FDN340P]
Q?#7  FDN340P  [FDN340P]
R?#37  DNM  [tro smd 0603]
R?#38  0R  [tro smd 0603]
R?#39  0R  [tro smd 0603]
R?#40  112k  [Tro smd 0603]
R?#41  0R  [tro smd 0603]
R?#42  DNM  [tro smd 0603]
R?#43  0R  [tro smd 0603]
R?#44  DNM  [tro smd 0603]
R?#45  DNM  [tro smd 0603]
R?#46  0R  [tro smd 0603]
R?#47  0R  [tro smd 0603]
R?#48  112k  [Tro smd 0603]
R?#49  0R  [tro smd 0603]
R?#50  DNM  [tro smd 0603]
R?#51  0R  [tro smd 0603]
R?#52  DNM  [tro smd 0603]
R?#53  10k  [tro smd 0603]
R?#54  10k  [tro smd 0603]
R?#55  100k  [tro smd 0603]
R?#56  100k  [tro smd 0603]
U?#13  LM358DT  [SOIC8]  (part A of 2)
U?#14  AD8237ARMZ-R7  [AD8237ARMZ-R7]
U?#15  LM358DT  [SOIC8]  (part B of 2)
U?#16  AD8237ARMZ-R7  [AD8237ARMZ-R7]
U?#17  ADS1115IDGSR  [AD8237ARMZ-R7]
VR?#1  VR 10k  [VR]
VR?#2  VR 10k  [VR]
VR?#3  VR 10k  [VR]
VR?#4  VR 10k  [VR]

### Ports
ADC_IN9 (bidir, see 9[2D]), ADC_IN9 (bidir, see 9[3A]), ADC_IN10 (bidir, see 9[2D]), ADC_IN10 (bidir, see 9[3B]), L_IN13 (bidir, see 9[1A]), L_IN13 (bidir, see 9[1B]), L_IN14 (bidir, see 9[1B]), L_IN14 (bidir, see 9[1C]), RDY/AL (bidir, see 7[7C], 8[7B]), S5_Ctrl (bidir), S6_Ctrl (bidir), SCL_Specs (bidir), SDA_Specs (bidir)

### Nets
+5V: R?#37.2 R?#45.2 R?#53.2 R?#54.2
+5V5: C?#32.2 Q?#6.2 Q?#7.2 R?#55.2 R?#56.2 U?#17.8(VDD)
+5V5_S5: C?#22.1 Q?#6.3 U?#14.5(+VS)
+5V5_S6: C?#28.1 Q?#7.3 U?#16.5(+VS)
+12V: C?#26.2 U?#13.8(VCC)
-12V: C?#25.1 U?#13.4(VSS)
GND: C?#22.2 C?#25.2 C?#26.1 C?#27.2 C?#28.2 C?#31.2 C?#32.1 D?#16.A D?#18.A R?#42.2 R?#43.2 R?#50.2 R?#51.2 U?#14.4(-VS) U?#16.4(-VS) U?#17.1(ADDR) U?#17.3(GND) VR?#1.3 VR?#3.3  [project net AGND]
V_REF_1: R?#44.1 VR?#1.2
V_REF_2: R?#52.1 VR?#3.2
NetC?#23_1: C?#23.1 R?#38.2 R?#39.1
NetC?#23_2: C?#23.2 C?#24.2 C?#29.2 C?#30.2 D?#15.A D?#17.A R?#42.1 R?#50.1 U?#14.3(IN-) U?#16.3(IN-) ; port L_IN14
NetC?#24_1: C?#24.1 R?#39.2 U?#14.2(IN+)
NetC?#27_1: C?#27.1 U?#14.1(BW)
NetC?#29_1: C?#29.1 R?#46.2 R?#47.1
NetC?#30_1: C?#30.1 R?#47.2 U?#16.2(IN+)
NetC?#31_1: C?#31.1 U?#16.1(BW)
NetD?#15_C: D?#15.C D?#17.C R?#38.1 R?#46.1 ; port L_IN13
NetD?#16_K: D?#16.K R?#37.1 VR?#1.1
NetD?#18_K: D?#18.K R?#45.1 VR?#3.1
NetQ?#6_1: Q?#6.1 R?#55.1 ; port S5_Ctrl
NetQ?#7_1: Q?#7.1 R?#56.1 ; port S6_Ctrl
NetR?#40_1: R?#40.1 U?#14.7(FB) VR?#2.2
NetR?#40_2: R?#40.2 U?#13.3 U?#14.8(OUT)
NetR?#41_1: R?#41.1 U?#14.6(REF)
NetR?#41_2: R?#41.2 R?#43.1 R?#44.2 VR?#2.1
NetR?#48_1: R?#48.1 U?#16.7(FB) VR?#4.2
NetR?#48_2: R?#48.2 U?#15.5 U?#16.8(OUT)
NetR?#49_1: R?#49.1 U?#16.6(REF)
NetR?#49_2: R?#49.2 R?#51.1 R?#52.2 VR?#4.1
NetR?#53_1: R?#53.1 U?#17.9(SDA) ; port SDA_Specs
NetR?#54_1: R?#54.1 U?#17.10(SCL) ; port SCL_Specs
NetU?#3_2: U?#17.2(ALERT/RDY) ; port RDY/AL
NetU?#13_1: U?#13.1 U?#13.2 U?#17.4(AIN0) ; port ADC_IN9
NetU?#15_6: U?#15.6 U?#15.7 U?#17.5(AIN1) ; port ADC_IN10

Not connected (* = marked no-connect by the designer): U?#17 6(AIN2)* 7(AIN3)*; VR?#2 3*; VR?#4 3*

### Notes on the sheet
- (near R?#54) ADDRESS = 1001000
- Title:
- Size:
- Date:
- A3
- Number:
- Time:
- Revision:
- Sheet
- of
- File:
- (in symbol FDN340P) D; S; G
- (in symbol LM358DT, part A) OUT
- (in symbol LM358DT, part B) OUT

### Library data of the parts
C?#22-C?#32 = Cap 0603: Capacitor SMD 0603
D?#15 D?#17 = PSD12C: Package SOD323, Diode TVS, 50 pF, 29.5 V
D?#16 D?#18 = BZT52C3V3: https://thegioiic.com/bzt52c3v3-diode-zener-3-3v-500mw
R?#37 R?#45 R?#53 R?#54 = Tro 0603 1% 10k: as R?#6 on sheet SOURCE POWER; Chung_Loai: Dán; Kieu_Chan: *
R?#38 R?#39 R?#41-R?#44 R?#46 R?#47 R?#49-R?#52 = Tro 0603 1% 0R: as R?#1 on sheet SOURCE POWER; Chung_Loai: Dán; Kieu_Chan: *
R?#40 R?#48 = Tro 0603 1% 33k: as R700 on sheet 4_20mA_Conv; Chung_Loai: Dán; Kieu_Chan: *
R?#55 R?#56 = Tro 0603 5% 100k: as R702 on sheet 4_20mA_Conv; Chung_Loai: Dán; Kieu_Chan: *
U?#13 U?#15 = LM358DT: as U?#4 on sheet 0_10V_Conv
U?#14 U?#16 = AD8237ARMZ-R7: as U701 on sheet 4_20mA_Conv; Supplier: Digikey; Supplier Part Number: AD8237ARMZ-R7CT-ND; Manufacturer Part Number: AD8237ARMZ-R7; RoHS: Yes; Category: Amplifiers - Op Amps, Buffer, Instrumentation; Stock: 5371; Pricing: 1=4.34, 10=2.871, 25=2.4888, 100=2.06, 250=1.8516, 500=1.72446 (USD); Case/Package: TSSOP; Pins: 8; Package Shape: Rectangular; Terminal Finish: Tin; Min Operating Temperature: -40°C; Max Operating Temperature: 125°C; JESD-609 Code: e3; Amplifier Type: INSTRUMENTATION AMPLIFIER; JESD-30 Code: R-PDSO-G8; Moisture Sensitivity Level: 1; Package Style: SMALL OUTLINE, THIN PROFILE, SHRINK PITCHMeter; Nominal Supply Voltage: 5V; Surface Mount: Yes; Technology: CMOS; Terminal Form: Gull Wing; Terminal Position: DUAL; Terminal Pitch: 0.635mm; Temperature Grade: AUTOMOTIVE; Reach SVHC Compliant: Yes; RoHS Compliant: Yes; ComponentLink1URL: https://datasheet.ciiva.com:443/pdfs/VipMasterIC/IC/ANDI/ANDIS13412/ANDIS13412-1.pdf?src-supplier=IHS+Markit; ComponentLink1Description: https://datasheet.ciiva.com:443/pdfs/VipMasterIC/IC/ANDI/ANDIS13412/ANDIS13412-1.pdf?src-supplier=IHS+Markit; ComponentLink2URL: https://datasheet.ciiva.com/6626/ad8237-6626733.pdf?src-supplier=Digikey; ComponentLink2Description: https://datasheet.ciiva.com/6626/ad8237-6626733.pdf?src-supplier=Digikey; ComponentLink3URL: https://datasheet.ciiva.com/8582/ad8237-8582303.pdf?src-supplier=Avnet; ComponentLink3Description: https://datasheet.ciiva.com/8582/ad8237-8582303.pdf?src-supplier=Avnet
U?#17 = ADS1115IDGSR: as U?#3 on sheet 4_20mA_Conv; Supplier: Digikey; Supplier Part Number: 296-38849-1-ND; Manufacturer Part Number: ADS1115IDGSR; RoHS: Yes; Category: Analog to Digital Converters (ADCs); Stock: 3443; Pricing: 1=4.96, 10=3.644, 25=3.3144, 100=2.952, 250=2.77904, 500=2.67478, 1000=2.58892 (USD); Case/Package: TSSOP; Pins: 10; Package Shape: Square; Terminal Finish: Nickel; Min Operating Temperature: -40°C; Max Operating Temperature: 125°C; JESD-609 Code: e4; Output Format: Serial; Converter Type: DELTA-SIGMA; JESD-30 Code: S-PDSO-G10; Moisture Sensitivity Level: 2; Package Style: SMALL OUTLINE, THIN PROFILE, SHRINK PITCHMeter; Peak Reflow Temperature (Cel): 260°C; Nominal Supply Voltage: 3.3V; Surface Mount: Yes; Terminal Form: Gull Wing; Terminal Position: DUAL; Length: 3mm; Width: 3mm; Height - Seated (Max): 1.1mm; Terminal Pitch: 0.5mm; Temperature Grade: AUTOMOTIVE; Reach SVHC Compliant: Yes; RoHS Compliant: Yes; ComponentLink1URL: https://www.ti.com:443/lit/ds/symlink/ads1113.pdf?src-supplier=IHS+Markit; ComponentLink1Description: https://www.ti.com:443/lit/ds/symlink/ads1113.pdf?src-supplier=IHS+Markit; ComponentLink2URL: https://datasheet.ciiva.com/4031/47725463s8438921n7713-4031028.pdf?src-supplier=Arrow+Electronics; ComponentLink2Description: https://datasheet.ciiva.com/4031/47725463s8438921n7713-4031028.pdf?src-supplier=Arrow+Electronics
VR?#1-VR?#4 = EVM3E-103: 10K Ohm, 20%

## Sheet MCU_STM32F4.SchDoc
size A; SheetNumber: 6; SheetTotal: 7

## Sheet WiFI_ESP.SchDoc
size A4; SheetNumber: 11; SheetTotal: 15
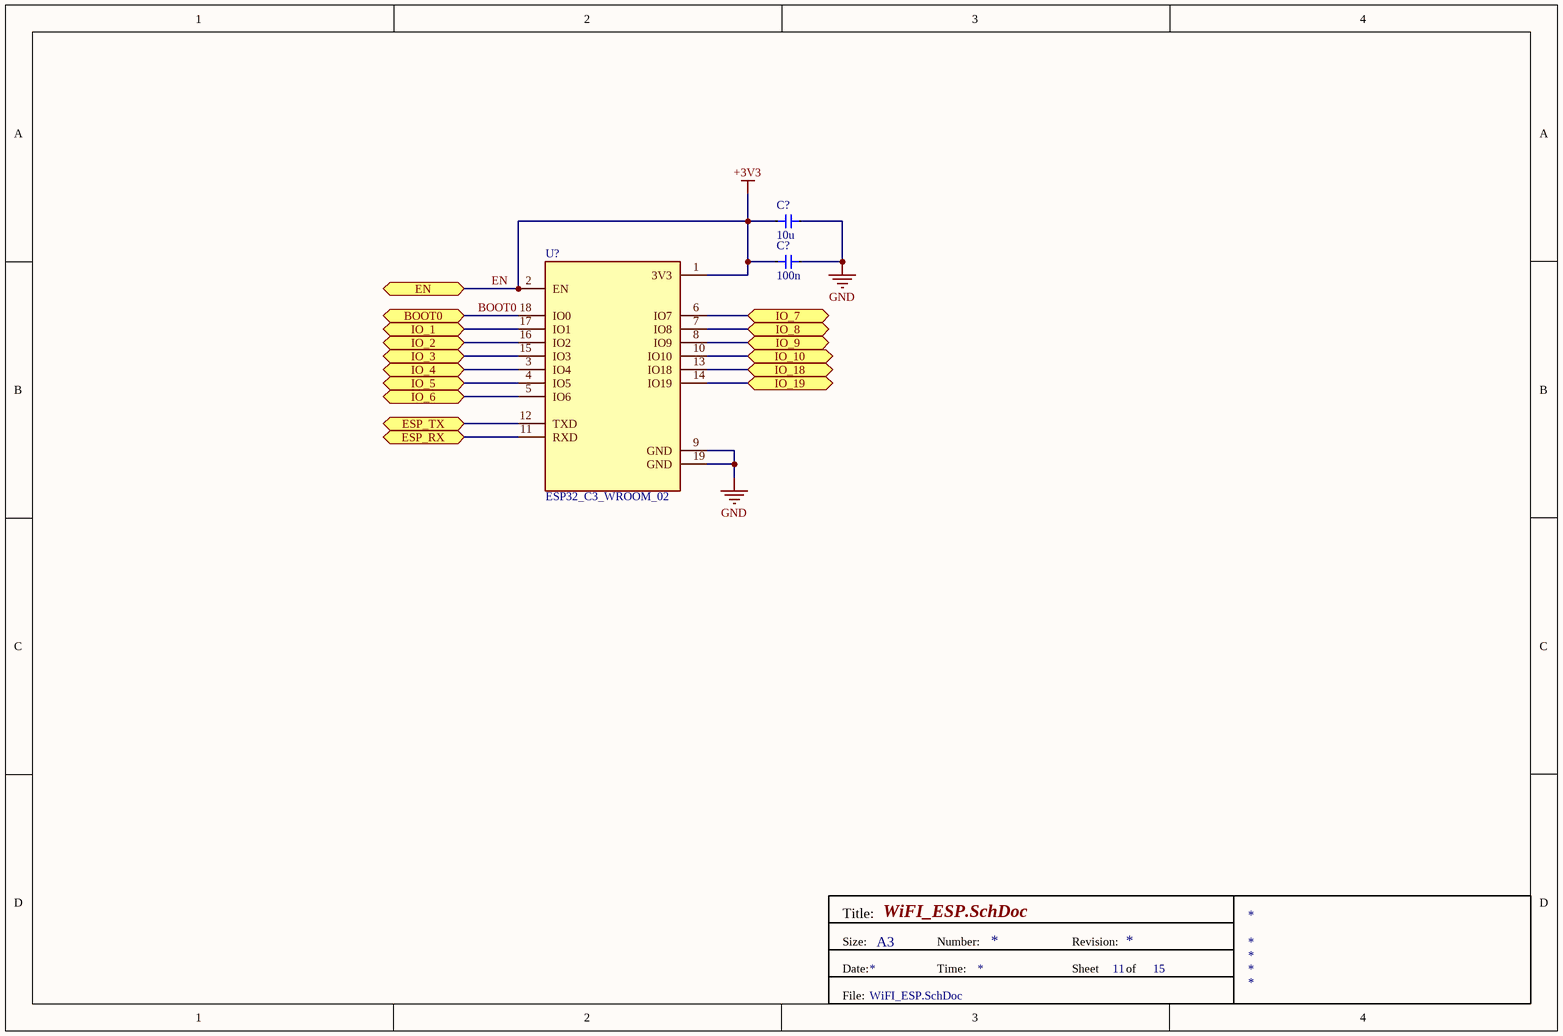
[diagram p7: WiFI_ESP.SchDoc]

### Parts
(Parts that share a designator on the sheet are numbered #1, #2 ... from top to bottom, then left to right.)
C?#33  10u  [Cap 0603]
C?#34  100n  [Cap 0603]
U?#18  ESP32_C3_WROOM_02  [ESP32_C3]

### Ports
BOOT0 (bidir), EN (bidir), ESP_RX (bidir), ESP_TX (bidir), IO_1 (bidir), IO_2 (bidir), IO_3 (bidir), IO_4 (bidir), IO_5 (bidir), IO_6 (bidir), IO_7 (bidir), IO_8 (bidir), IO_9 (bidir), IO_10 (bidir), IO_18 (bidir), IO_19 (bidir)

### Nets
EN: C?#33.2 C?#34.2 U?#18.1(3V3) U?#18.2(EN) ; port EN  [also labelled +3V3]
GND: C?#33.1 C?#34.1 U?#18.9(GND) U?#18.19(GND)  [project net AGND]
BOOT0: U?#18.18(IO0) ; port BOOT0
NetU?#18_3: U?#18.3(IO4) ; port IO_4
NetU?#18_4: U?#18.4(IO5) ; port IO_5
NetU?#18_5: U?#18.5(IO6) ; port IO_6
NetU?#18_6: U?#18.6(IO7) ; port IO_7
NetU?#18_7: U?#18.7(IO8) ; port IO_8
NetU?#18_8: U?#18.8(IO9) ; port IO_9
NetU?#18_10: U?#18.10(IO10) ; port IO_10
NetU?#18_11: U?#18.11(RXD) ; port ESP_RX
NetU?#18_12: U?#18.12(TXD) ; port ESP_TX
NetU?#18_13: U?#18.13(IO18) ; port IO_18
NetU?#18_14: U?#18.14(IO19) ; port IO_19
NetU?#18_15: U?#18.15(IO3) ; port IO_3
NetU?#18_16: U?#18.16(IO2) ; port IO_2
NetU?#18_17: U?#18.17(IO1) ; port IO_1

### Notes on the sheet
- Title:
- Size:
- Date:
- A3
- Number:
- Time:
- Revision:
- Sheet
- of
- File:

### Library data of the parts
C?#33 C?#34 = Cap 0603: Capacitor SMD 0603
U?#18 = ESP32_C3_WROOM_02: Ultra-Low-Power SoC with RISC-V Single-Core CPU / 2.4 GHz Wi-Fi (802.11b/g/n) and Bluetooth® 5 (LE) / Optional 4 MB flash in the chip’s package / QFN32 (5×5 mm) package

## Sheet micro_SD and GPS.SchDoc
size A; SheetNumber: 11; SheetTotal: 12

## Sheet LoRa.SchDoc
size A; SheetNumber: 12; SheetTotal: 12

## Sheet CONNECTIVE.SchDoc
size A; SheetNumber: 13; SheetTotal: 13

## Sheet DOC_REVISION_HISTORY.SchDoc
size A; SheetNumber: 14; SheetTotal: 14

## Nets that join several sheets
+5V: 4_20mA_Conv (6 pins), 0_10V_Conv (6 pins), SPECIAL_INPUT (R?#37.2 R?#45.2 R?#53.2 R?#54.2)
+5V5: 4_20mA_Conv (11 pins), 0_10V_Conv (C?#15.2 U?#8.8), SPECIAL_INPUT (6 pins)
+12V: 4_20mA_Conv (C704.2 C714.2 U700.8 U703.8), 0_10V_Conv (10 pins), SPECIAL_INPUT (C?#26.2 U?#13.8)
-12V: 4_20mA_Conv (C703.1 C713.1 U700.4 U703.4), 0_10V_Conv (10 pins), SPECIAL_INPUT (C?#25.1 U?#13.4)
AGND: SOURCE POWER (20 pins), 4_20mA_Conv (44 pins), 0_10V_Conv (23 pins), SPECIAL_INPUT (19 pins), WiFI_ESP (C?#33.1 C?#34.1 U?#18.9 U?#18.19)
EN: SOURCE POWER (R?#7.2 R?#9.2), WiFI_ESP (C?#33.2 C?#34.2 U?#18.1 U?#18.2)
NetU?#3_2: 4_20mA_Conv (U?#3.2), 0_10V_Conv (U?#8.2), SPECIAL_INPUT (U?#17.2)